# EAGLE design sequencer (EAGLE 5.11)

## Sheet 1 of 3
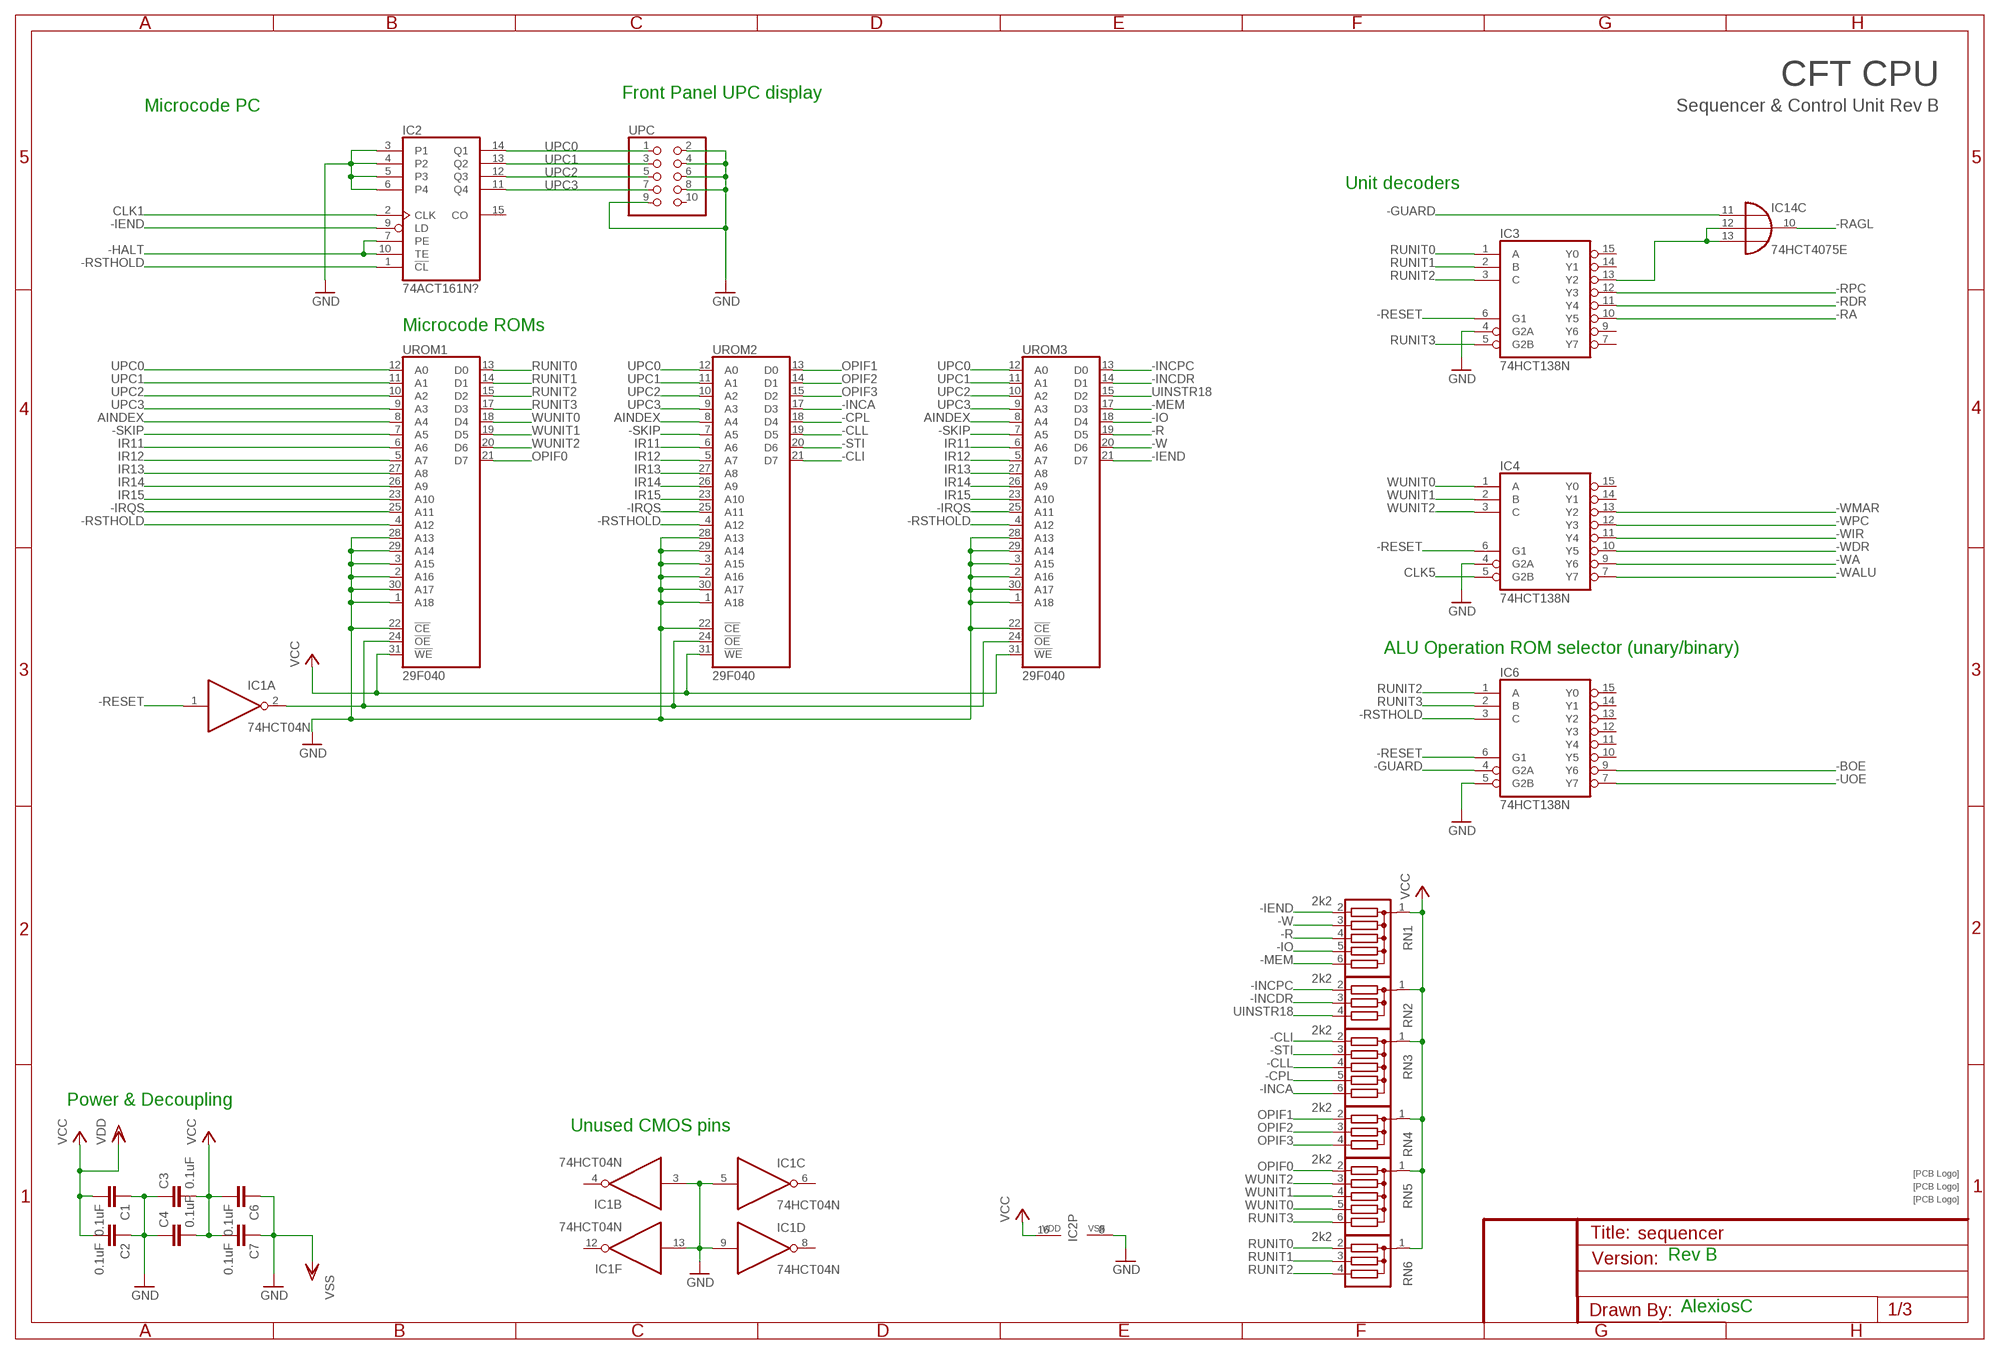
[diagram p0: schematic, sheet 1]

### Parts
C1  0.1uF  C-EU025-025X050  [C025-025X050]
C2  0.1uF  C-EU025-025X050  [C025-025X050]
C3  0.1uF  C-EU025-025X050  [C025-025X050]
C4  0.1uF  C-EU025-025X050  [C025-025X050]
C6  0.1uF  C-EU025-025X050  [C025-025X050]
C7  0.1uF  C-EU025-025X050  [C025-025X050]
IC1  74HCT04N  [DIL14]
IC2  74ACT161N?  4161P  [DIL16]
IC3  74HCT138N  [DIL16]
IC4  74HCT138N  [DIL16]
IC6  74HCT138N  [DIL16]
IC14  74HCT4075E  4075N  [DIL14]
RN1  2k2  G05R  [SIL6]
RN2  2k2  G03R  [SIL4]
RN3  2k2  G05R  [SIL6]
RN4  2k2  G03R  [SIL4]
RN5  2k2  G05R  [SIL6]
RN6  2k2  G03R  [SIL4]
U$1  SIGNATUREPLANE  [SIGNATURE_PLANE]
U$2  SIGNATUREPLANE  [SIGNATURE_PLANE]
U$3  SIGNATURESILK  [SIGNATURE]
UPC  PINHD-2X5/90  [2X05/90]
UROM1  29F040  29F040DIP32  [DIL32]
UROM2  29F040  29F040DIP32  [DIL32]
UROM3  29F040  29F040DIP32  [DIL32]

### Nets
-BOE: IC6.9(Y6) ; also sheet 3
-CLI: RN3.2 UROM2.21(D7) ; also sheet 3
-CLL: RN3.4 UROM2.19(D5) ; also sheet 3
-CPL: RN3.5 UROM2.18(D4) ; also sheet 3
-GUARD: IC6.4(G2A) IC14.11(C:I0) ; also sheet 3
-HALT: IC2.7(PE) IC2.10(TE) ; also sheet 3
-IEND: IC2.9(LD) RN1.2 UROM3.21(D7) ; also sheet 3
-INCA: RN3.6 UROM2.17(D3) ; also sheet 3
-INCDR: RN2.3 UROM3.14(D1) ; also sheet 3
-INCPC: RN2.2 UROM3.13(D0) ; also sheet 3
-IO: RN1.5 UROM3.18(D4) ; also sheet 3
-IRQS: UROM1.25(A11) UROM2.25(A11) UROM3.25(A11) ; also sheet 3
-MEM: RN1.6 UROM3.17(D3) ; also sheet 3
-R: RN1.4 UROM3.19(D5) ; also sheet 3
-RA: IC3.10(Y5) ; also sheet 3
-RAGL: IC14.10(C:O) ; also sheet 2,3
-RDR: IC3.11(Y4) ; also sheet 3
-RESET: IC1.1(A:I) IC3.6(G1) IC4.6(G1) IC6.6(G1) ; also sheet 2,3
-RPC: IC3.12(Y3) ; also sheet 3
-RSTHOLD: IC2.1(!CL) IC6.3(C) UROM1.4(A12) UROM2.4(A12) UROM3.4(A12) ; also sheet 2,3
-SKIP: UROM1.7(A5) UROM2.7(A5) UROM3.7(A5) ; also sheet 2,3
-STI: RN3.3 UROM2.20(D6) ; also sheet 3
-UOE: IC6.7(Y7) ; also sheet 3
-W: RN1.3 UROM3.20(D6) ; also sheet 3
-WA: IC4.9(Y6) ; also sheet 3
-WALU: IC4.7(Y7) ; also sheet 3
-WDR: IC4.10(Y5) ; also sheet 3
-WIR: IC4.11(Y4) ; also sheet 2,3
-WMAR: IC4.13(Y2) ; also sheet 3
-WPC: IC4.12(Y3) ; also sheet 3
AINDEX: UROM1.8(A4) UROM2.8(A4) UROM3.8(A4) ; also sheet 3
CLK1: IC2.2(CLK) ; also sheet 2,3
CLK5: IC4.5(G2B) ; also sheet 3
GND [Power]: C1.1 C2.1 C3.1 C4.1 C6.1 C7.1 IC1.3(B:I) IC1.5(C:I) IC1.9(D:I) IC1.13(F:I) IC2.3(P1) IC2.4(P2) IC2.5(P3) IC2.6(P4) IC2.8(VSS) IC3.4(G2A) IC4.4(G2A) IC6.5(G2B) UPC.2 UPC.4 UPC.6 UPC.8 UPC.9 UROM1.1(A18) UROM1.2(A16) UROM1.3(A15) UROM1.22(!CE) UROM1.28(A13) UROM1.29(A14) UROM1.30(A17) UROM2.1(A18) UROM2.2(A16) UROM2.3(A15) UROM2.22(!CE) UROM2.28(A13) UROM2.29(A14) UROM2.30(A17) UROM3.1(A18) UROM3.2(A16) UROM3.3(A15) UROM3.22(!CE) UROM3.28(A13) UROM3.29(A14) UROM3.30(A17) ; supply symbol labelled VSS ; also sheet 2,3
IR11: UROM1.6(A6) UROM2.6(A6) UROM3.6(A6) ; also sheet 2
IR12: UROM1.5(A7) UROM2.5(A7) UROM3.5(A7) ; also sheet 2
IR13: UROM1.27(A8) UROM2.27(A8) UROM3.27(A8) ; also sheet 2
IR14: UROM1.26(A9) UROM2.26(A9) UROM3.26(A9) ; also sheet 2
IR15: UROM1.23(A10) UROM2.23(A10) UROM3.23(A10) ; also sheet 2
N$1: IC1.2(A:O) UROM1.24(!OE) UROM2.24(!OE) UROM3.24(!OE)
N$3: IC3.13(Y2) IC14.12(C:I1) IC14.13(C:I2)
OPIF0: RN5.2 UROM1.21(D7) ; also sheet 2,3
OPIF1: RN4.2 UROM2.13(D0) ; also sheet 2,3
OPIF2: RN4.3 UROM2.14(D1) ; also sheet 2,3
OPIF3: RN4.4 UROM2.15(D2) ; also sheet 2,3
RUNIT0: IC3.1(A) RN6.2 UROM1.13(D0) ; also sheet 3
RUNIT1: IC3.2(B) RN6.3 UROM1.14(D1) ; also sheet 3
RUNIT2: IC3.3(C) IC6.1(A) RN6.4 UROM1.15(D2) ; also sheet 3
RUNIT3: IC3.5(G2B) IC6.2(B) RN5.6 UROM1.17(D3) ; also sheet 3
UINSTR18: RN2.4 UROM3.15(D2) ; also sheet 3
UPC0: IC2.14(Q1) UPC.1 UROM1.12(A0) UROM2.12(A0) UROM3.12(A0)
UPC1: IC2.13(Q2) UPC.3 UROM1.11(A1) UROM2.11(A1) UROM3.11(A1)
UPC2: IC2.12(Q3) UPC.5 UROM1.10(A2) UROM2.10(A2) UROM3.10(A2)
UPC3: IC2.11(Q4) UPC.7 UROM1.9(A3) UROM2.9(A3) UROM3.9(A3)
VCC [Power]: C1.2 C2.2 C3.2 C4.2 C6.2 C7.2 IC2.16(VDD) RN1.1 RN2.1 RN3.1 RN4.1 RN5.1 RN6.1 UROM1.31(!WE) UROM2.31(!WE) UROM3.31(!WE) ; supply symbol labelled VDD ; also sheet 2,3
WUNIT0: IC4.1(A) RN5.5 UROM1.18(D4)
WUNIT1: IC4.2(B) RN5.4 UROM1.19(D5)
WUNIT2: IC4.3(C) RN5.3 UROM1.20(D6)
Unconnected: IC1.4(B:O) IC1.6(C:O) IC1.8(D:O) IC1.12(F:O) IC2.15(CO) IC3.7(Y7) IC3.9(Y6) IC3.14(Y1) IC3.15(Y0) IC4.14(Y1) IC4.15(Y0) IC6.10(Y5) IC6.11(Y4) IC6.12(Y3) IC6.13(Y2) IC6.14(Y1) IC6.15(Y0) UPC.10

### Notes on the sheet
- CFT CPU
- Front Panel UPC display
- Microcode PC | Sequencer & Control Unit Rev B
- Unit decoders
- Microcode ROMs
- ALU Operation ROM selector (unary/binary)
- Power & Decoupling
- Unused CMOS pins
- Rev B
- AlexiosC

## Sheet 2 of 3
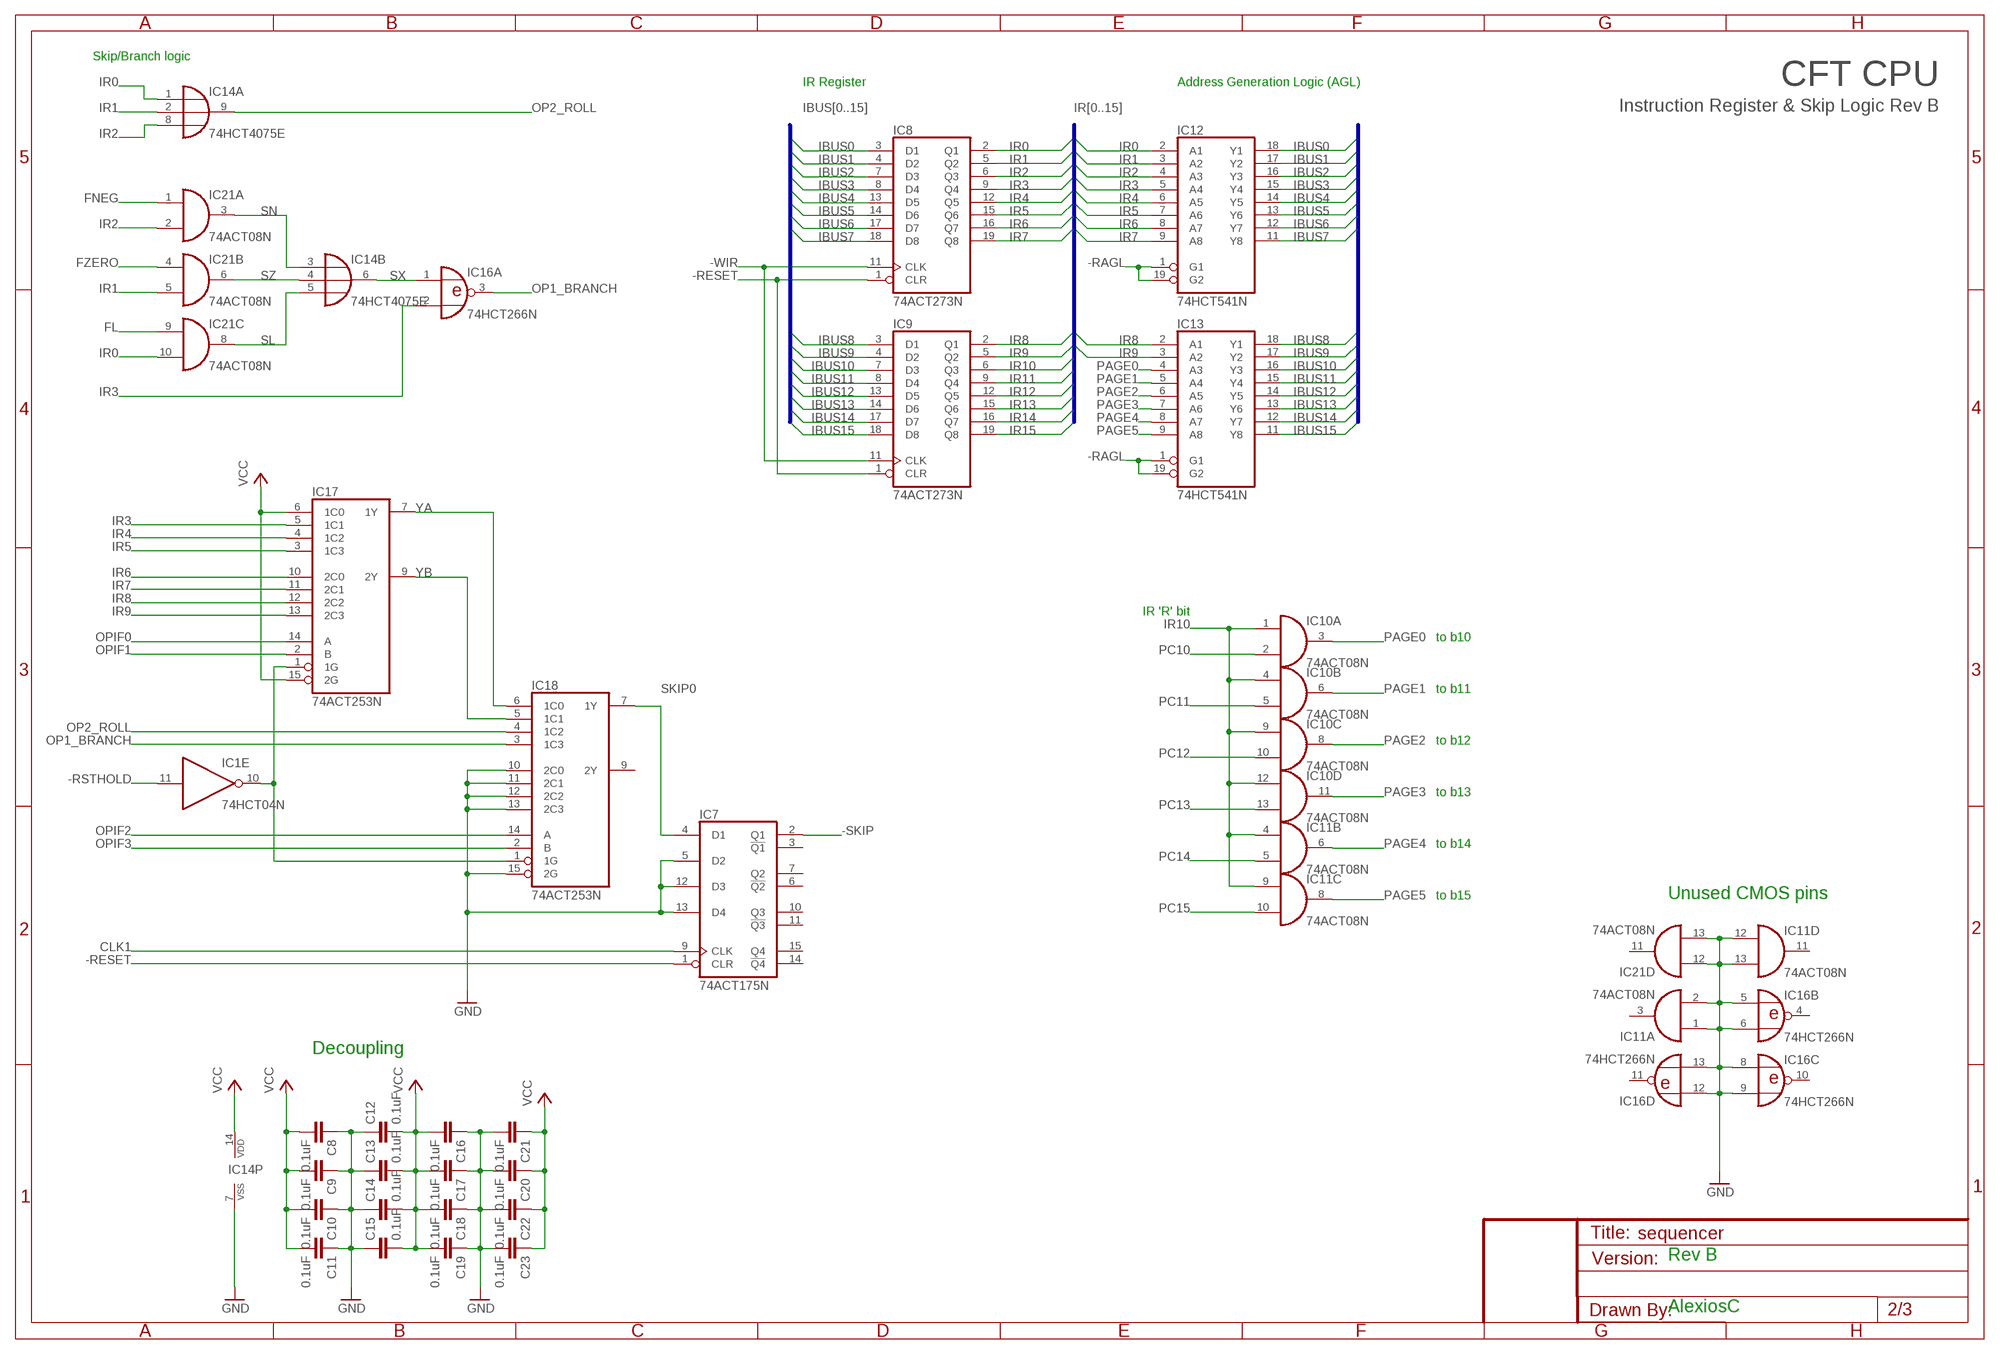
[diagram p1: schematic, sheet 2]

### Parts
C8  0.1uF  C-EU025-025X050  [C025-025X050]
C9  0.1uF  C-EU025-025X050  [C025-025X050]
C10  0.1uF  C-EU025-025X050  [C025-025X050]
C11  0.1uF  C-EU025-025X050  [C025-025X050]
C12  0.1uF  C-EU025-025X050  [C025-025X050]
C13  0.1uF  C-EU025-025X050  [C025-025X050]
C14  0.1uF  C-EU025-025X050  [C025-025X050]
C15  0.1uF  C-EU025-025X050  [C025-025X050]
C16  0.1uF  C-EU025-025X050  [C025-025X050]
C17  0.1uF  C-EU025-025X050  [C025-025X050]
C18  0.1uF  C-EU025-025X050  [C025-025X050]
C19  0.1uF  C-EU025-025X050  [C025-025X050]
C20  0.1uF  C-EU025-025X050  [C025-025X050]
C21  0.1uF  C-EU025-025X050  [C025-025X050]
C22  0.1uF  C-EU025-025X050  [C025-025X050]
C23  0.1uF  C-EU025-025X050  [C025-025X050]
IC7  74ACT175N  [DIL16]
IC8  74ACT273N  [DIL20]
IC9  74ACT273N  [DIL20]
IC10  74ACT08N  [DIL14]
IC11  74ACT08N  [DIL14]
IC12  74HCT541N  [DIL20]
IC13  74HCT541N  [DIL20]
IC16  74HCT266N  74HC266N  [DIL14]
IC17  74ACT253N  [DIL16]
IC18  74ACT253N  [DIL16]
IC21  74ACT08N  [DIL14]

### Nets
-RAGL: IC12.1(G1) IC12.19(G2) IC13.1(G1) IC13.19(G2) ; also sheet 1,3
-RESET: IC7.1(CLR) IC8.1(CLR) IC9.1(CLR) ; also sheet 1,3
-RSTHOLD: IC1.11(E:I) ; also sheet 1,3
-SKIP: IC7.2(Q1) ; also sheet 1,3
-WIR: IC8.11(CLK) IC9.11(CLK) ; also sheet 1,3
CLK1: IC7.9(CLK) ; also sheet 1,3
FL: IC21.9(C:I0) ; also sheet 3
FNEG: IC21.1(A:I0) ; also sheet 3
FZERO: IC21.4(B:I0) ; also sheet 3
GND [Power]: C8.1 C9.1 C10.1 C11.1 C12.1 C13.1 C14.1 C15.1 C16.1 C17.1 C18.1 C19.1 C20.2 C21.2 C22.2 C23.2 IC7.5(D2) IC7.12(D3) IC7.13(D4) IC11.1(A:I0) IC11.2(A:I1) IC11.12(D:I0) IC11.13(D:I1) IC14.7(P:VSS) IC16.5(B:I0) IC16.6(B:I1) IC16.8(C:I0) IC16.9(C:I1) IC16.12(D:I0) IC16.13(D:I1) IC18.10(2C0) IC18.11(2C1) IC18.12(2C2) IC18.13(2C3) IC18.15(2G) IC21.12(D:I0) IC21.13(D:I1) ; also sheet 1,3
IBUS0: IC8.3(D1) IC12.18(Y1) ; also sheet 3
IBUS1: IC8.4(D2) IC12.17(Y2) ; also sheet 3
IBUS2: IC8.7(D3) IC12.16(Y3) ; also sheet 3
IBUS3: IC8.8(D4) IC12.15(Y4) ; also sheet 3
IBUS4: IC8.13(D5) IC12.14(Y5) ; also sheet 3
IBUS5: IC8.14(D6) IC12.13(Y6) ; also sheet 3
IBUS6: IC8.17(D7) IC12.12(Y7) ; also sheet 3
IBUS7: IC8.18(D8) IC12.11(Y8) ; also sheet 3
IBUS8: IC9.3(D1) IC13.18(Y1) ; also sheet 3
IBUS9: IC9.4(D2) IC13.17(Y2) ; also sheet 3
IBUS10: IC9.7(D3) IC13.16(Y3) ; also sheet 3
IBUS11: IC9.8(D4) IC13.15(Y4) ; also sheet 3
IBUS12: IC9.13(D5) IC13.14(Y5) ; also sheet 3
IBUS13: IC9.14(D6) IC13.13(Y6) ; also sheet 3
IBUS14: IC9.17(D7) IC13.12(Y7) ; also sheet 3
IBUS15: IC9.18(D8) IC13.11(Y8) ; also sheet 3
IR0: IC8.2(Q1) IC12.2(A1) IC14.1(A:I0) IC21.10(C:I1)
IR1: IC8.5(Q2) IC12.3(A2) IC14.2(A:I1) IC21.5(B:I1)
IR2: IC8.6(Q3) IC12.4(A3) IC14.8(A:I2) IC21.2(A:I1)
IR3: IC8.9(Q4) IC12.5(A4) IC16.2(A:I1) IC17.5(1C1)
IR4: IC8.12(Q5) IC12.6(A5) IC17.4(1C2)
IR5: IC8.15(Q6) IC12.7(A6) IC17.3(1C3)
IR6: IC8.16(Q7) IC12.8(A7) IC17.10(2C0)
IR7: IC8.19(Q8) IC12.9(A8) IC17.11(2C1)
IR8: IC9.2(Q1) IC13.2(A1) IC17.12(2C2)
IR9: IC9.5(Q2) IC13.3(A2) IC17.13(2C3)
IR10: IC9.6(Q3) IC10.1(A:I0) IC10.4(B:I0) IC10.9(C:I0) IC10.12(D:I0) IC11.4(B:I0) IC11.9(C:I0)
IR11: IC9.9(Q4) ; also sheet 1
IR12: IC9.12(Q5) ; also sheet 1
IR13: IC9.15(Q6) ; also sheet 1
IR14: IC9.16(Q7) ; also sheet 1
IR15: IC9.19(Q8) ; also sheet 1
OP1_BRANCH: IC16.3(A:O) IC18.3(1C3)
OP2_ROLL: IC14.9(A:O) IC18.4(1C2)
OPIF0: IC17.14(A) ; also sheet 1,3
OPIF1: IC17.2(B) ; also sheet 1,3
OPIF2: IC18.14(A) ; also sheet 1,3
OPIF3: IC18.2(B) ; also sheet 1,3
PAGE0: IC10.3(A:O) IC13.4(A3)
PAGE1: IC10.6(B:O) IC13.5(A4)
PAGE2: IC10.8(C:O) IC13.6(A5)
PAGE3: IC10.11(D:O) IC13.7(A6)
PAGE4: IC11.6(B:O) IC13.8(A7)
PAGE5: IC11.8(C:O) IC13.9(A8)
PC10: IC10.2(A:I1) ; also sheet 3
PC11: IC10.5(B:I1) ; also sheet 3
PC12: IC10.10(C:I1) ; also sheet 3
PC13: IC10.13(D:I1) ; also sheet 3
PC14: IC11.5(B:I1) ; also sheet 3
PC15: IC11.10(C:I1) ; also sheet 3
RSTHOLD: IC1.10(E:O) IC17.1(1G) IC18.1(1G)
SKIP0: IC7.4(D1) IC18.7(1Y)
SL: IC14.5(B:I2) IC21.8(C:O)
SN: IC14.3(B:I0) IC21.3(A:O)
SX: IC14.6(B:O) IC16.1(A:I0)
SZ: IC14.4(B:I1) IC21.6(B:O)
VCC [Power]: C8.2 C9.2 C10.2 C11.2 C12.2 C13.2 C14.2 C15.2 C16.2 C17.2 C18.2 C19.2 C20.1 C21.1 C22.1 C23.1 IC14.14(P:VDD) IC17.6(1C0) IC17.15(2G) ; also sheet 1,3
YA: IC17.7(1Y) IC18.6(1C0)
YB: IC17.9(2Y) IC18.5(1C1)
Unconnected: IC7.3(!Q1) IC7.6(!Q2) IC7.7(Q2) IC7.10(Q3) IC7.11(!Q3) IC7.14(!Q4) IC7.15(Q4) IC11.3(A:O) IC11.11(D:O) IC16.4(B:O) IC16.10(C:O) IC16.11(D:O) IC18.9(2Y) IC21.11(D:O)

### Buses
IBUS[0..15]
IR[0..15]

### Notes on the sheet
- Skip/Branch logic
- IR Register | Address Generation Logic (AGL) | CFT CPU
- Instruction Register & Skip Logic Rev B
- IR 'R' bit
- to b10
- to b11
- to b12
- to b13
- to b14
- to b15 | Unused CMOS pins
- Decoupling
- Rev B
- AlexiosC

## Sheet 3 of 3
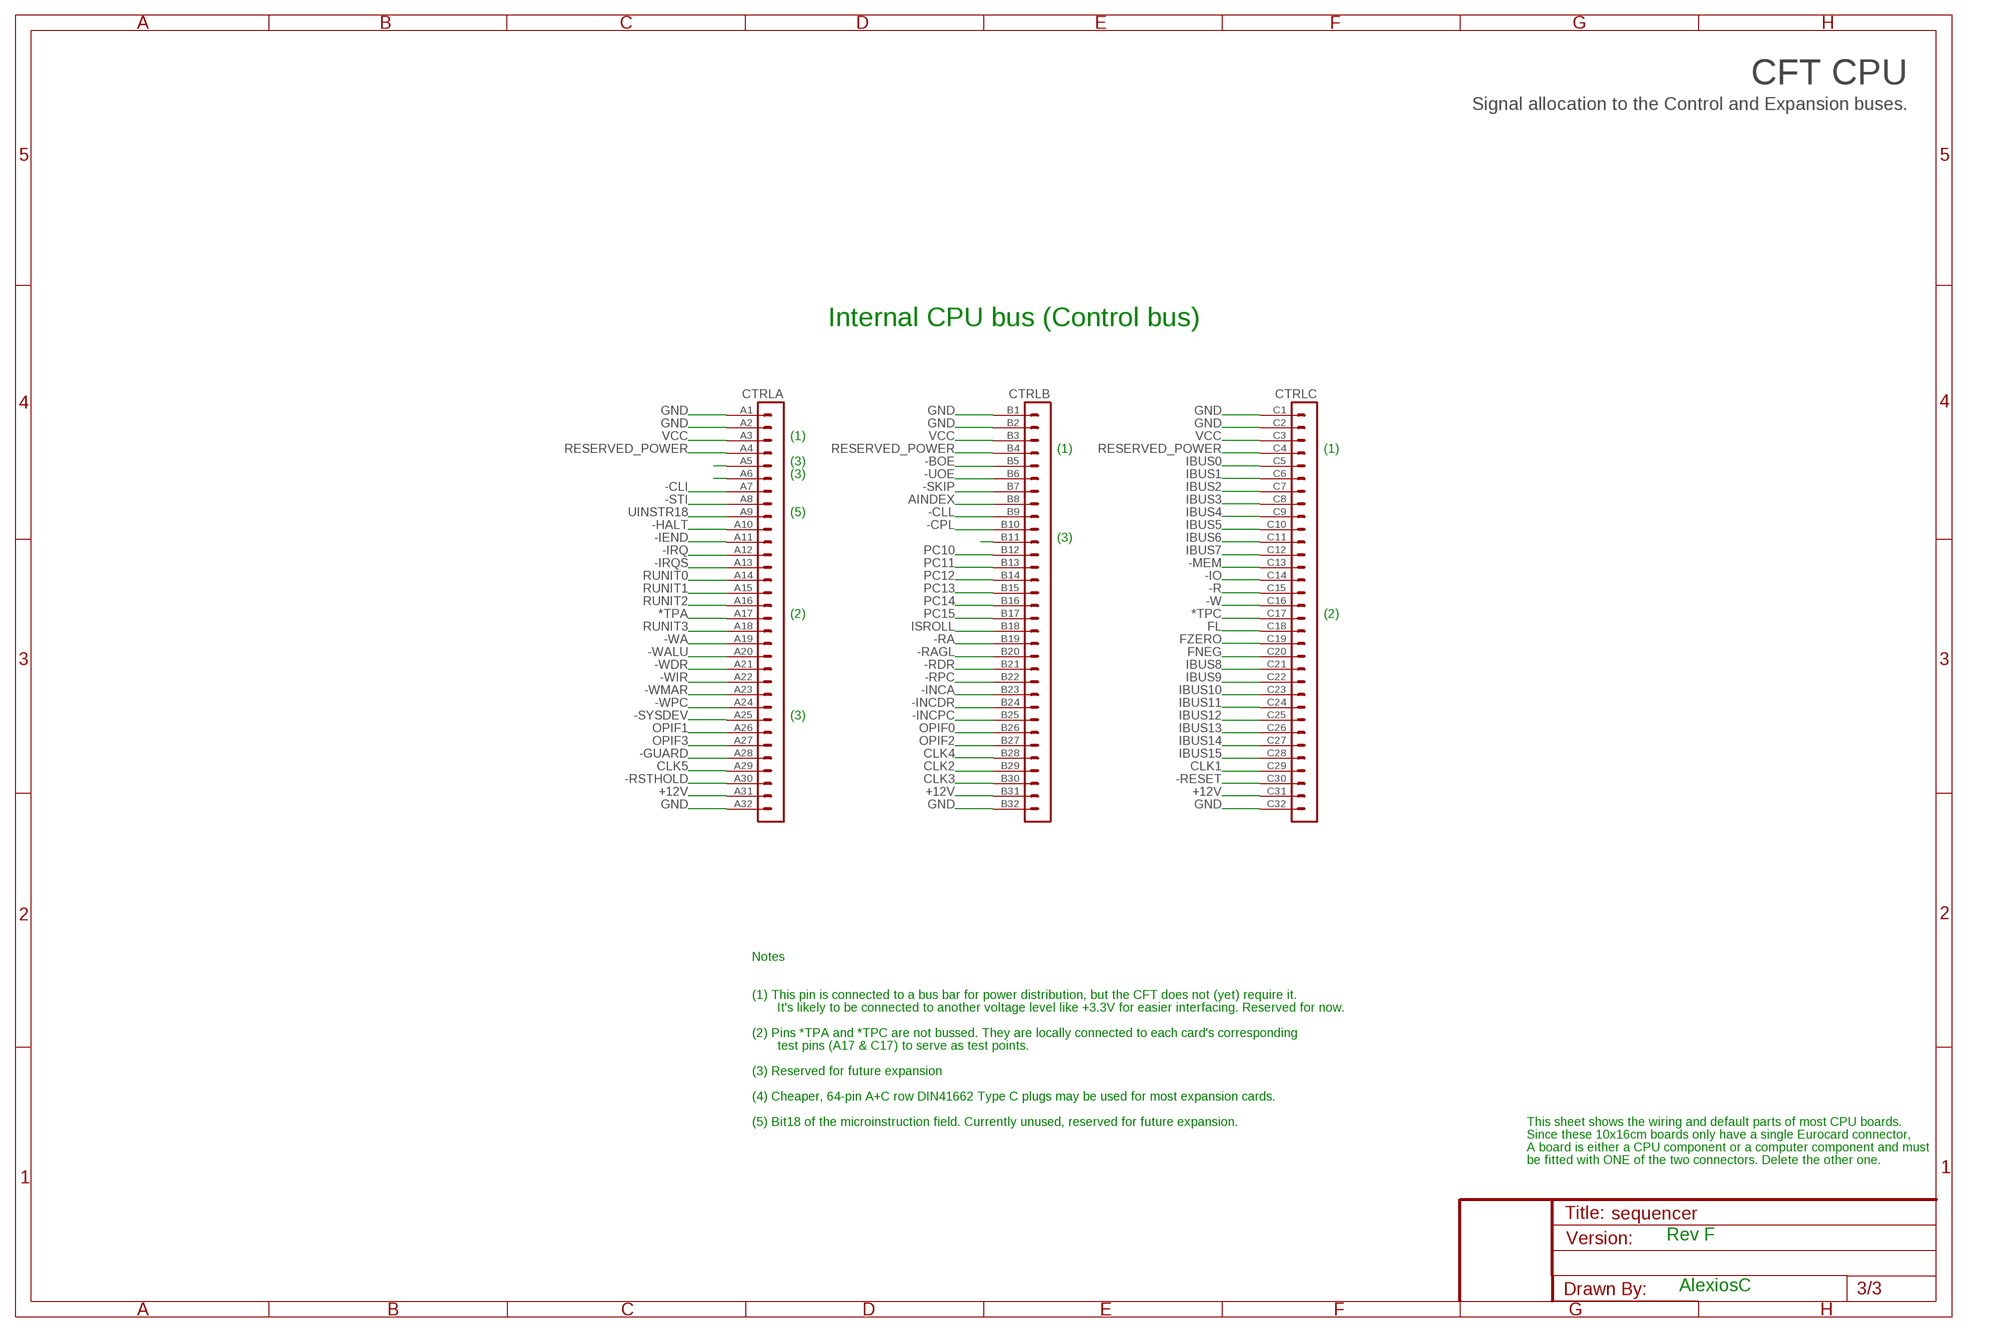
[diagram p2: schematic, sheet 3]

### Parts
CTRL  VG96-3B  [VG96B]

### Nets
*TPA: CTRL.A17
*TPC: CTRL.C17
+12V [12V]: CTRL.A31 CTRL.B31 CTRL.C31
-BOE: CTRL.B5 ; also sheet 1
-CLI: CTRL.A7 ; also sheet 1
-CLL: CTRL.B9 ; also sheet 1
-CPL: CTRL.B10 ; also sheet 1
-GUARD: CTRL.A28 ; also sheet 1
-HALT: CTRL.A10 ; also sheet 1
-IEND: CTRL.A11 ; also sheet 1
-INCA: CTRL.B23 ; also sheet 1
-INCDR: CTRL.B24 ; also sheet 1
-INCPC: CTRL.B25 ; also sheet 1
-IO: CTRL.C14 ; also sheet 1
-IRQ: CTRL.A12
-IRQS: CTRL.A13 ; also sheet 1
-MEM: CTRL.C13 ; also sheet 1
-R: CTRL.C15 ; also sheet 1
-RA: CTRL.B19 ; also sheet 1
-RAGL: CTRL.B20 ; also sheet 1,2
-RDR: CTRL.B21 ; also sheet 1
-RESET: CTRL.C30 ; also sheet 1,2
-RPC: CTRL.B22 ; also sheet 1
-RSTHOLD: CTRL.A30 ; also sheet 1,2
-SKIP: CTRL.B7 ; also sheet 1,2
-STI: CTRL.A8 ; also sheet 1
-SYSDEV: CTRL.A25
-UOE: CTRL.B6 ; also sheet 1
-W: CTRL.C16 ; also sheet 1
-WA: CTRL.A19 ; also sheet 1
-WALU: CTRL.A20 ; also sheet 1
-WDR: CTRL.A21 ; also sheet 1
-WIR: CTRL.A22 ; also sheet 1,2
-WMAR: CTRL.A23 ; also sheet 1
-WPC: CTRL.A24 ; also sheet 1
AINDEX: CTRL.B8 ; also sheet 1
CLK1: CTRL.C29 ; also sheet 1,2
CLK2: CTRL.B29
CLK3: CTRL.B30
CLK4: CTRL.B28
CLK5: CTRL.A29 ; also sheet 1
FL: CTRL.C18 ; also sheet 2
FNEG: CTRL.C20 ; also sheet 2
FZERO: CTRL.C19 ; also sheet 2
GND [Power]: CTRL.A1 CTRL.A2 CTRL.A32 CTRL.B1 CTRL.B2 CTRL.B32 CTRL.C1 CTRL.C2 CTRL.C32 ; also sheet 1,2
IBUS0: CTRL.C5 ; also sheet 2
IBUS1: CTRL.C6 ; also sheet 2
IBUS2: CTRL.C7 ; also sheet 2
IBUS3: CTRL.C8 ; also sheet 2
IBUS4: CTRL.C9 ; also sheet 2
IBUS5: CTRL.C10 ; also sheet 2
IBUS6: CTRL.C11 ; also sheet 2
IBUS7: CTRL.C12 ; also sheet 2
IBUS8: CTRL.C21 ; also sheet 2
IBUS9: CTRL.C22 ; also sheet 2
IBUS10: CTRL.C23 ; also sheet 2
IBUS11: CTRL.C24 ; also sheet 2
IBUS12: CTRL.C25 ; also sheet 2
IBUS13: CTRL.C26 ; also sheet 2
IBUS14: CTRL.C27 ; also sheet 2
IBUS15: CTRL.C28 ; also sheet 2
ISROLL: CTRL.B18
N$13: CTRL.A5
N$47: CTRL.B11
N$51: CTRL.A6
OPIF0: CTRL.B26 ; also sheet 1,2
OPIF1: CTRL.A26 ; also sheet 1,2
OPIF2: CTRL.B27 ; also sheet 1,2
OPIF3: CTRL.A27 ; also sheet 1,2
PC10: CTRL.B12 ; also sheet 2
PC11: CTRL.B13 ; also sheet 2
PC12: CTRL.B14 ; also sheet 2
PC13: CTRL.B15 ; also sheet 2
PC14: CTRL.B16 ; also sheet 2
PC15: CTRL.B17 ; also sheet 2
RESERVED_POWER: CTRL.A4 CTRL.B4 CTRL.C4
RUNIT0: CTRL.A14 ; also sheet 1
RUNIT1: CTRL.A15 ; also sheet 1
RUNIT2: CTRL.A16 ; also sheet 1
RUNIT3: CTRL.A18 ; also sheet 1
UINSTR18: CTRL.A9 ; also sheet 1
VCC [Power]: CTRL.A3 CTRL.B3 CTRL.C3 ; also sheet 1,2

### Notes on the sheet
- CFT CPU
- Signal allocation to the Control and Expansion buses.
- Internal CPU bus (Control bus)
- (1)
- (1) | (1)
- (3)
- (3)
- (5)
- (3)
- (2) | (2)
- (3)
- Notes
- (1) This pin is connected to a bus bar for power distribution, but the CFT does not (yet) require it.
- It's likely to be connected to another voltage level like +3.3V for easier interfacing. Reserved for now.
- (2) Pins *TPA and *TPC are not bussed. They are locally connected to each card's corresponding
- test pins (A17 & C17) to serve as test points.
- (3) Reserved for future expansion
- (4) Cheaper, 64-pin A+C row DIN41662 Type C plugs may be used for most expansion cards.
- (5) Bit18 of the microinstruction field. Currently unused, reserved for future expansion. | This sheet shows the wiring and default parts of most CPU boards.
- Since these 10x16cm boards only have a single Eurocard connector,
- A board is either a CPU component or a computer component and must
- be fitted with ONE of the two connectors. Delete the other one.
- Rev F
- AlexiosC

## Power pins joined to a net without a drawn wire
GND: IC1.7(P:GND) IC3.8(GND) IC4.8(GND) IC6.8(GND) IC7.8(GND) IC8.10(GND) IC9.10(GND) IC10.7(P:GND) IC11.7(P:GND) IC12.10(GND) IC13.10(GND) IC16.7(P:GND) IC17.8(GND) IC18.8(GND) IC21.7(P:GND) UROM1.16(GND) UROM2.16(GND) UROM3.16(GND)
VCC: IC1.14(P:VCC) IC3.16(VCC) IC4.16(VCC) IC6.16(VCC) IC7.16(VCC) IC8.20(VCC) IC9.20(VCC) IC10.14(P:VCC) IC11.14(P:VCC) IC12.20(VCC) IC13.20(VCC) IC16.14(P:VCC) IC17.16(VCC) IC18.16(VCC) IC21.14(P:VCC) UROM1.32(VCC) UROM2.32(VCC) UROM3.32(VCC)

## Library data of the parts
C1-C4 C6-C23 = rcl:C-EU: CAPACITOR, European symbol
CTRL = 19inch:VG96-3: PCB EUROCARD, 96-pin type C/ABC, 2.54 mm
IC1 = 74xx-eu:74*04: Hex INVERTER
IC2 = 41xx:4161: 41xx DEVICE
IC3 IC4 IC6 = 74xx-eu:74*138: 3-line to 8-line DECODER/DEMULTIPLEXER
IC7 = 74xx-eu:74*175: Qadruple D type FLIP FLOP, clear
IC8 IC9 = 74xx-eu:74*273: Octal D type FLIP FLOP, clear
IC10 IC11 IC21 = 74xx-eu:74*08: Quad 2-input AND gate
IC12 IC13 = 74xx-eu:74*541: Octal BUFFER and LINE DRIVER, 3-state
IC14 = 40xx:4075: Triple 3-input OR
IC16 = 74xx-eu:74*266: Quadruple EXCLUSIVE-NOR (XNOR), open-collector
IC17 IC18 = 74xx-eu:74*253: Dual 4-to 1 line data SELECTOR/MULTIPLEXER, 3-state
RN1 RN3 RN5 = resistor-sil:G05R: SIL RESISTOR; OC_FARNELL: unknown; OC_NEWARK: unknown
RN2 RN4 RN6 = resistor-sil:G03R: SIL RESISTOR; OC_FARNELL: unknown; OC_NEWARK: unknown
U$1-U$3 = alexios:SIGNATURE: Soup signature
UPC = pinhead:PINHD-2X5: PIN HEADER
UROM1-UROM3 = alexios:29F040: 4-mbit (512x8) Flash memory in a PLCC32 package (with socket). AM29F040 is an example of this.

## Net classes
0 default: width 0.305 mm, clearance 0.254 mm
1 Power: width 0.914 mm, clearance 0.254 mm
2 12V: width 1.27 mm, clearance 0.508 mm

## Board
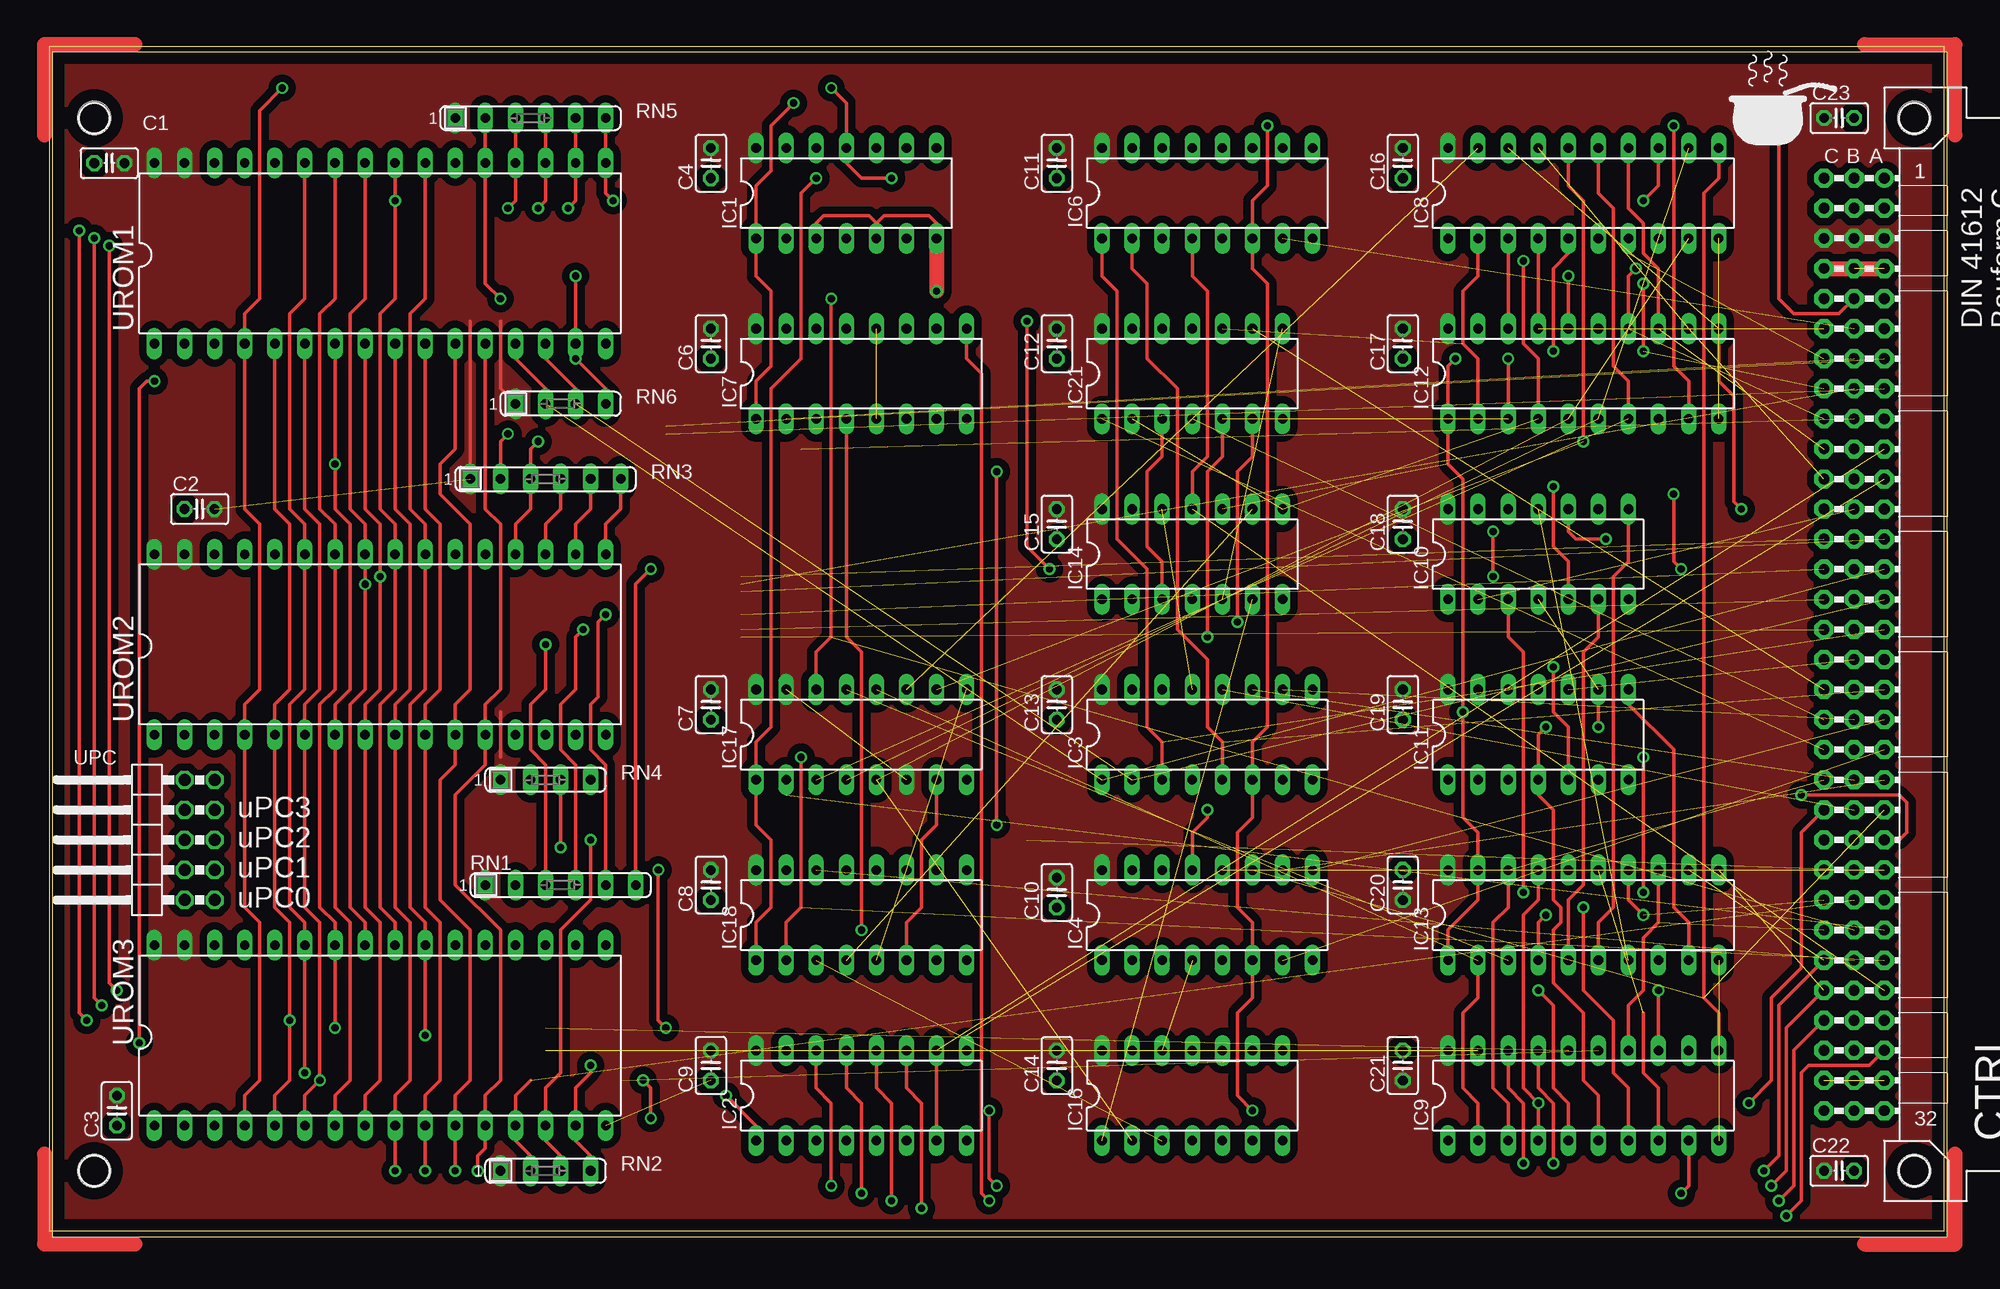
[diagram p3: board, top side]
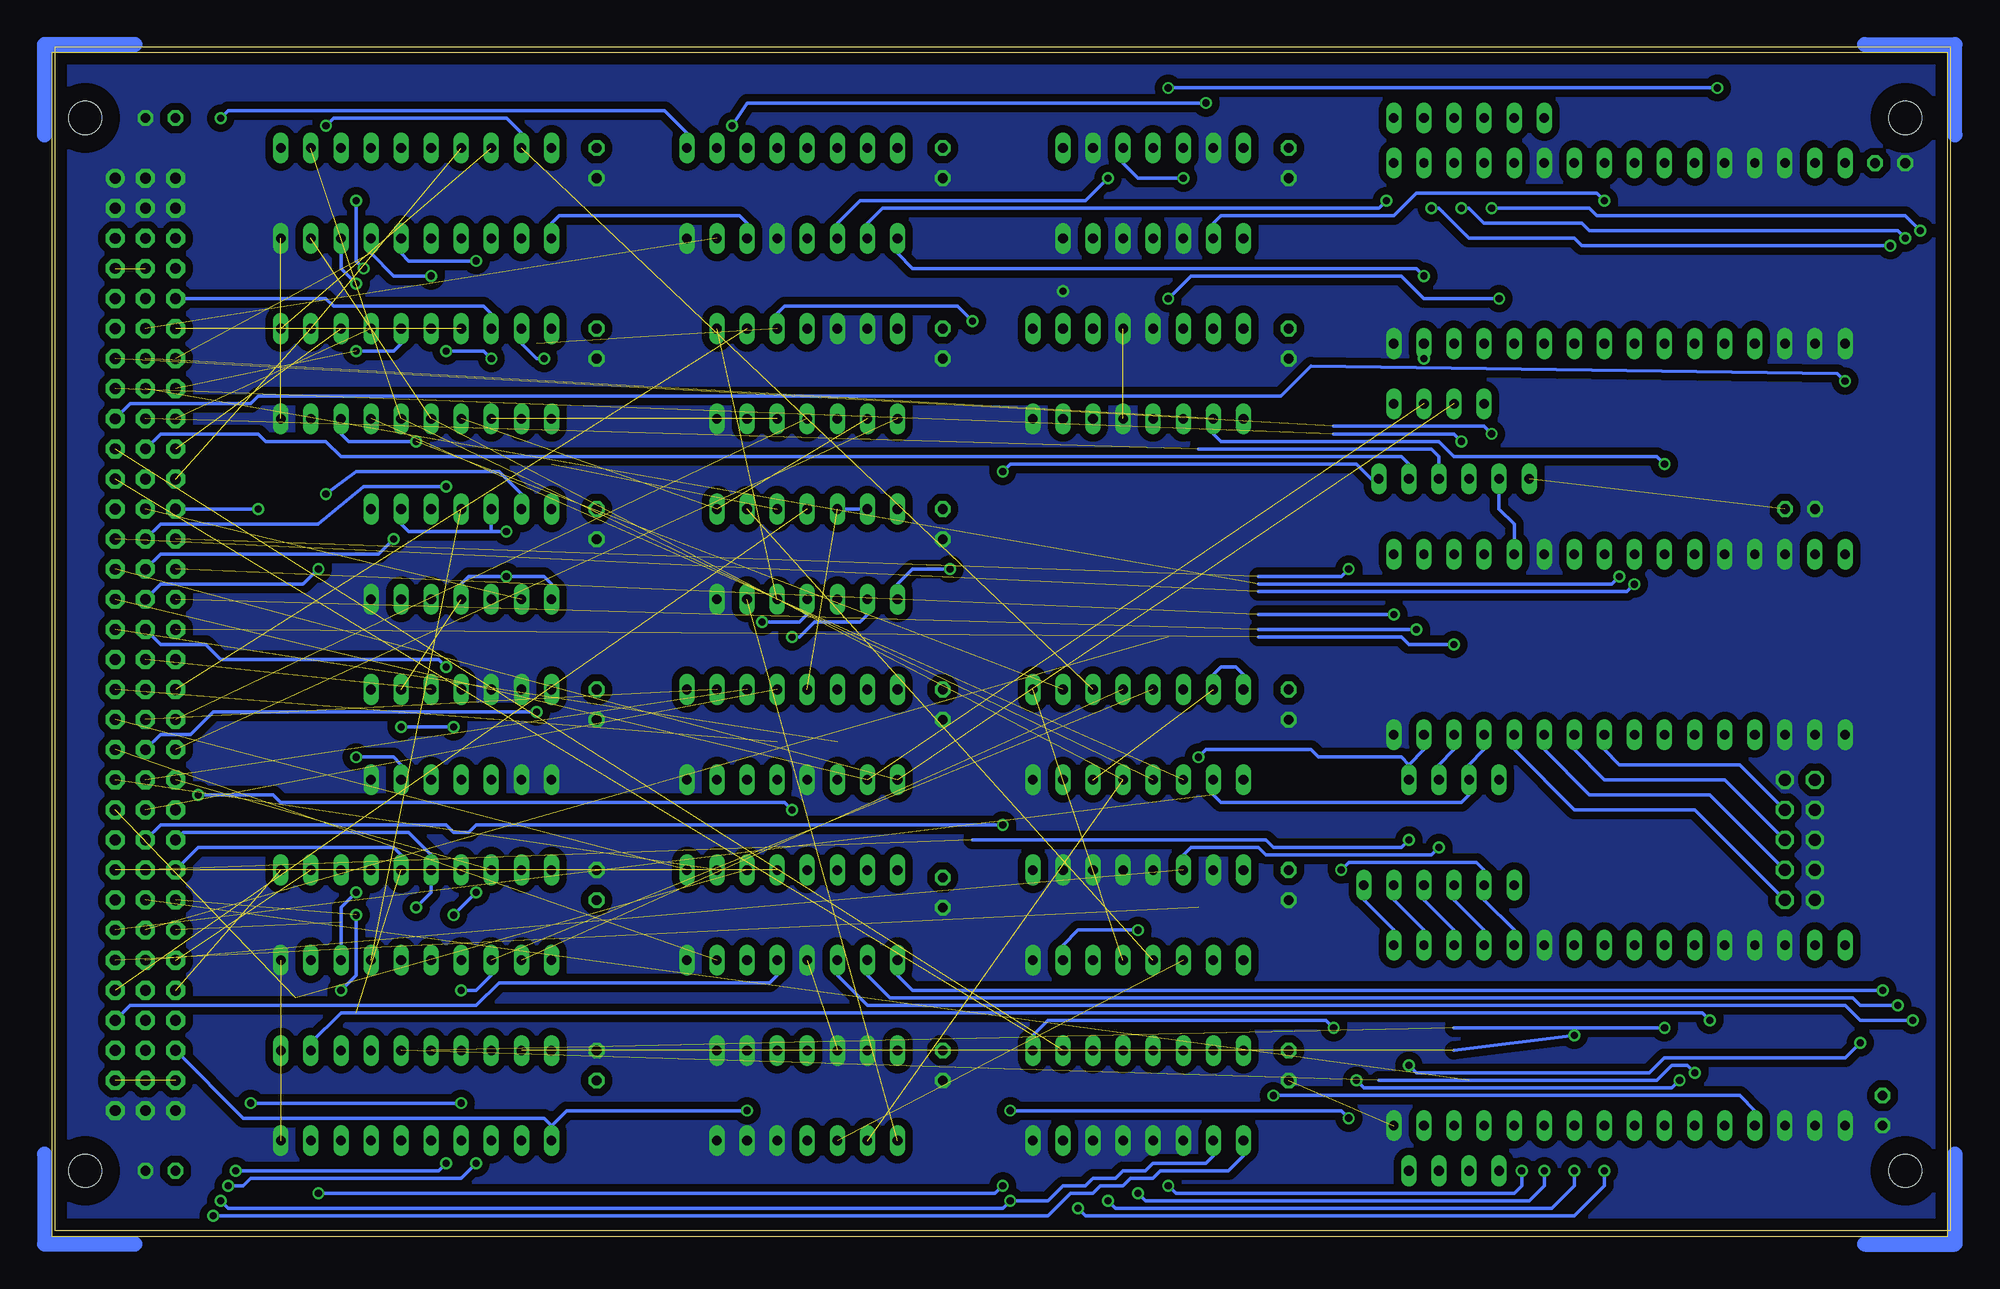
[diagram p4: board, bottom side, seen from below]

Size 160 x 100 mm. Coordinates in mm from the lower left corner, seen from the top.
Outline: 0,0 160,0 160,100 0,100 0,0
Copper layers (1*16): Top 0.035mm / dielectric 1.5mm / Bottom 0.035mm
Design rules "olimex-10mil": minimum track width 10mil, minimum drill 24mil, track to track 10mil, track to pad 10mil, pad to pad 10mil, via to via 10mil, smd to smd 10mil, copper to edge 40mil, drill to drill 10mil, minimum pad ring 10mil, minimum via ring 8mil, stop-mask expansion 0mil, vias tented up to drill 0mil, thermal gap 10mil

### Footprints (pad centres in the part's own frame; a part is rotated, then mirrored left to right if it is on the bottom)
C025-025X050 = drill 0.813 octagon: 1 -1.27,0; 2 1.27,0
VG96B = drill 0.914 pad 1.6 round: A1 154.94,39.37 | drill 0.914 pad 1.6 octagon: A2 154.94,36.83; A3 154.94,34.29; A4 154.94,31.75; A5 154.94,29.21; A6 154.94,26.67; A7 154.94,24.13; A8 154.94,21.59; A9 154.94,19.05; A10 154.94,16.51; A11 154.94,13.97; A12 154.94,11.43; A13 154.94,8.89; A14 154.94,6.35; A15 154.94,3.81; A16 154.94,1.27; A17 154.94,-1.27; A18 154.94,-3.81; A19 154.94,-6.35; A20 154.94,-8.89; A21 154.94,-11.43; A22 154.94,-13.97; A23 154.94,-16.51; A24 154.94,-19.05; A25 154.94,-21.59; A26 154.94,-24.13; A27 154.94,-26.67; A28 154.94,-29.21; A29 154.94,-31.75; A30 154.94,-34.29; A31 154.94,-36.83; A32 154.94,-39.37; B1 152.4,39.37; B2 152.4,36.83; B3 152.4,34.29; B4 152.4,31.75; B5 152.4,29.21; B6 152.4,26.67; B7 152.4,24.13; B8 152.4,21.59; B9 152.4,19.05; B10 152.4,16.51; B11 152.4,13.97; B12 152.4,11.43; B13 152.4,8.89; B14 152.4,6.35; B15 152.4,3.81; B16 152.4,1.27; B17 152.4,-1.27; B18 152.4,-3.81; B19 152.4,-6.35; B20 152.4,-8.89; B21 152.4,-11.43; B22 152.4,-13.97; B23 152.4,-16.51; B24 152.4,-19.05; B25 152.4,-21.59; B26 152.4,-24.13; B27 152.4,-26.67; B28 152.4,-29.21; B29 152.4,-31.75; B30 152.4,-34.29; B31 152.4,-36.83; B32 152.4,-39.37; C1 149.86,39.37; C2 149.86,36.83; C3 149.86,34.29; C4 149.86,31.75; C5 149.86,29.21; C6 149.86,26.67; C7 149.86,24.13; C8 149.86,21.59; C9 149.86,19.05; C10 149.86,16.51; C11 149.86,13.97; C12 149.86,11.43; C13 149.86,8.89; C14 149.86,6.35; C15 149.86,3.81; C16 149.86,1.27; C17 149.86,-1.27; C18 149.86,-3.81; C19 149.86,-6.35; C20 149.86,-8.89; C21 149.86,-11.43; C22 149.86,-13.97; C23 149.86,-16.51; C24 149.86,-19.05; C25 149.86,-21.59; C26 149.86,-24.13; C27 149.86,-26.67; C28 149.86,-29.21; C29 149.86,-31.75; C30 149.86,-34.29; C31 149.86,-36.83; C32 149.86,-39.37 | hole 2.794: 157.48,44.45; 157.48,-44.45; 3.81,44.45; 3.81,-44.45
DIL14 = drill 0.813 long: 1 -7.62,-3.81; 2 -5.08,-3.81; 3 -2.54,-3.81; 4 0,-3.81; 5 2.54,-3.81; 6 5.08,-3.81; 7 7.62,-3.81; 8 7.62,3.81; 9 5.08,3.81; 10 2.54,3.81; 11 0,3.81; 12 -2.54,3.81; 13 -5.08,3.81; 14 -7.62,3.81
DIL16 = drill 0.813 long: 1 -8.89,-3.81; 2 -6.35,-3.81; 3 -3.81,-3.81; 4 -1.27,-3.81; 5 1.27,-3.81; 6 3.81,-3.81; 7 6.35,-3.81; 8 8.89,-3.81; 9 8.89,3.81; 10 6.35,3.81; 11 3.81,3.81; 12 1.27,3.81; 13 -1.27,3.81; 14 -3.81,3.81; 15 -6.35,3.81; 16 -8.89,3.81
DIL20 = drill 0.813 long: 1 -11.43,-3.81; 2 -8.89,-3.81; 3 -6.35,-3.81; 4 -3.81,-3.81; 5 -1.27,-3.81; 6 1.27,-3.81; 7 3.81,-3.81; 8 6.35,-3.81; 9 8.89,-3.81; 10 11.43,-3.81; 11 11.43,3.81; 12 8.89,3.81; 13 6.35,3.81; 14 3.81,3.81; 15 1.27,3.81; 16 -1.27,3.81; 17 -3.81,3.81; 18 -6.35,3.81; 19 -8.89,3.81; 20 -11.43,3.81
SIL6 = drill 0.813 long: 1 -6.35,0; 2 -3.81,0; 3 -1.27,0; 4 1.27,0; 5 3.81,0; 6 6.35,0
SIL4 = drill 0.813 long: 1 -3.81,0; 2 -1.27,0; 3 1.27,0; 4 3.81,0
2X05/90 = drill 1.016 octagon: 1 -5.08,-6.35; 2 -5.08,-3.81; 3 -2.54,-6.35; 4 -2.54,-3.81; 5 0,-6.35; 6 0,-3.81; 7 2.54,-6.35; 8 2.54,-3.81; 9 5.08,-6.35; 10 5.08,-3.81
DIL32 = drill 0.813 long: 1 -19.05,-7.62; 2 -16.51,-7.62; 3 -13.97,-7.62; 4 -11.43,-7.62; 5 -8.89,-7.62; 6 -6.35,-7.62; 7 -3.81,-7.62; 8 -1.27,-7.62; 9 1.27,-7.62; 10 3.81,-7.62; 11 6.35,-7.62; 12 8.89,-7.62; 13 11.43,-7.62; 14 13.97,-7.62; 15 16.51,-7.62; 16 19.05,-7.62 | drill 0.8 long: 17 19.05,7.62; 18 16.51,7.62; 19 13.97,7.62; 20 11.43,7.62; 21 8.89,7.62; 22 6.35,7.62; 23 3.81,7.62; 24 1.27,7.62; 25 -1.27,7.62; 26 -3.81,7.62; 27 -6.35,7.62; 28 -8.89,7.62; 29 -11.43,7.62; 30 -13.97,7.62; 31 -16.51,7.62; 32 -19.05,7.62

### Placement (x,y rotation side)
C1  5.08,90.17 0 top
C2  12.7,60.96 0 top
C3  5.71,10.16 90 top
C4  55.88,90.17 90 top
C6  55.88,74.93 90 top
C7  55.88,44.45 90 top
C8  55.88,29.21 90 top
C9  55.88,13.97 90 top
C10  85.09,28.57 90 top
C11  85.09,90.17 90 top
C12  85.09,74.93 90 top
C13  85.09,44.45 90 top
C14  85.09,13.97 90 top
C15  85.09,59.69 90 top
C16  114.3,90.17 90 top
C17  114.3,74.93 90 top
C18  114.3,59.69 90 top
C19  114.3,44.45 90 top
C20  114.3,29.21 90 top
C21  114.3,13.97 90 top
C22  151.13,5.08 0 top
C23  151.13,93.98 0 top
CTRL  0,49.53 0 top
IC1  67.31,87.63 0 top
IC2  68.58,11.43 0 top
IC3  97.79,41.91 0 top
IC4  97.79,26.67 0 top
IC6  97.79,87.63 0 top
IC7  68.58,72.39 0 top
IC8  129.54,87.63 0 top
IC9  129.54,11.43 0 top
IC10  125.73,57.15 0 top
IC11  125.73,41.91 0 top
IC12  129.54,72.39 0 top
IC13  129.54,26.67 0 top
IC14  96.52,57.15 0 top
IC16  96.52,11.43 0 top
IC17  68.58,41.91 0 top
IC18  68.58,26.67 0 top
IC21  96.52,72.39 0 top
RN1  43.18,29.21 0 top
RN2  41.91,5.08 0 top
RN3  41.91,63.5 0 top
RN4  41.91,38.1 0 top
RN5  40.64,93.98 0 top
RN6  43.18,69.85 0 top
U$1  36.2,106.68 0 bottom  (outside the outline)
U$2  18.41,106.68 0 top  (outside the outline)
U$3  142.24,91.44 0 top
UPC  7.62,33.02 90 top
UROM1  27.94,82.55 0 top
UROM2  27.94,49.53 0 top
UROM3  27.94,16.51 0 top

### Tracks (layer width: path | path; a pad name or v marks a point on that pad's centre or on a via)
+12V  (2 unrouted)
-BOE  (via drill 0.6)
  Top 0.305: v146.05,93.98 146.05,78.74 147.32,77.47 151.13,77.47 CTRL.B5
  Bottom 0.305: IC6.9 106.68,92.71 108.58,94.61 145.41,94.61 v146.05,93.98
-CLI  (via drill 0.6)  (1 unrouted)
  Top 0.305: RN3.2 38.1,66.67 v38.73,67.31
  Bottom 0.305: UROM2.21 36.83,59.69 38.1,60.96 RN3.2 | v38.73,67.31 39.37,67.94 52.07,67.94
-CLL  (1 unrouted)
  Top 0.305: UROM2.19 41.91,59.69 43.18,60.96 RN3.4
  Bottom 0.305: RN3.4 43.18,65.41 43.81,66.04 63.5,66.04
-CPL
  Top 0.305: UROM2.18 44.45,59.69 45.72,60.96 RN3.5
  Bottom 0.305: RN3.5 45.72,64.77 46.35,65.41 135.89,65.41 137.16,66.67 142.24,66.67 142.88,67.31 151.13,67.31 CTRL.B10
-GUARD  (1 unrouted)
  Top 0.305: IC6.4 96.52,80.64 97.79,79.38 97.79,65.41 96.52,64.14 IC14.11
-HALT  (1 unrouted)
  Top 0.305: IC2.7 IC2.10
-IEND  (via drill 0.6)  (1 unrouted)
  Top 0.305: v51.44,30.48 51.44,17.78 v52.07,17.14
  Bottom 0.305: UROM3.21 36.83,25.4 39.37,27.94 RN1.2 39.37,30.48 40.01,31.11 50.8,31.11 v51.44,30.48 | v52.07,17.14 52.7,17.78 76.2,17.78 77.47,16.51 IC2.9
-INCA  (via drill 0.6)
  Top 0.305: UROM2.17 46.99,59.69 48.26,60.96 RN3.6 | v80.01,64.14 v80.01,34.29
  Bottom 0.305: RN3.6 48.9,63.5 50.16,64.77 79.38,64.77 v80.01,64.14 | v80.01,34.29 124.46,34.29 125.09,33.66 126.36,33.66 127,34.29 151.13,34.29 CTRL.B23
-INCDR  (via drill 0.6)  (1 unrouted)
  Top 0.305: RN2.3 43.18,6.35 41.91,7.62 UROM3.14 41.91,12.06 43.18,13.34 43.18,25.4 45.72,27.94 v45.72,33.02
  Bottom 0.305: v45.72,33.02 46.35,32.38 57.15,32.38 57.78,33.02 82.55,33.02
-INCPC  (1 unrouted)
  Top 0.305: RN2.2 40.64,6.35 39.37,7.62 UROM3.13 39.37,11.43 40.64,12.7
-IO  (via drill 0.6)  (1 unrouted)
  Top 0.305: RN1.5 46.99,39.37 45.72,40.64 45.72,44.45 46.35,45.09 46.35,51.44 v46.99,52.07
  Bottom 0.305: UROM3.18 44.45,25.4 46.99,27.94 RN1.5 | v46.99,52.07 58.42,52.07
-IRQS  (via drill 0.6)  (1 unrouted)
  Top 0.305: UROM1.25 26.67,78.74 25.4,77.47 25.4,60.96 26.67,59.69 UROM2.25 v26.67,54.61 26.67,45.72 25.4,44.45 25.4,27.3 26.67,26.04 UROM3.25
  Bottom 0.305: v26.67,54.61 27.3,53.98 58.42,53.98
-MEM  (via drill 0.6)  (1 unrouted)
  Top 0.305: RN1.6 49.53,54.61 v50.8,55.88
  Bottom 0.305: UROM3.17 46.99,25.4 49.53,27.94 RN1.6 | v50.8,55.88 51.44,55.24 58.42,55.24
-R  (via drill 0.6)  (1 unrouted)
  Top 0.305: RN1.4 44.45,39.37 43.18,40.64 43.18,44.45 44.45,45.72 44.45,50.16 v45.09,50.8
  Bottom 0.305: UROM3.19 41.91,25.4 44.45,27.94 RN1.4 | v45.09,50.8 58.42,50.8
-RA  (1 unrouted)
-RAGL  (via drill 0.6)  (1 unrouted)
  Top 0.305: IC13.1 118.11,25.4 120.65,27.94 IC13.19 120.65,33.66 119.38,34.92 v119.38,43.81 119.38,63.5 118.11,64.77 IC12.1 118.11,73.03 v118.75,73.66
  Bottom 0.305: CTRL.B20 151.13,41.91 148.59,41.91 146.69,43.81 v119.38,43.81 | IC12.19 120.65,74.93 119.38,73.66 v118.75,73.66
-RDR  (1 unrouted)
-RESET  (via drill 0.6)
  Top 0.305: IC7.1 59.69,71.75 60.96,73.03 60.96,79.38 59.69,80.64 IC1.1 59.69,88.27 60.96,89.53 60.96,93.34 v62.87,95.25 | v101.6,10.16 100.33,11.43 100.33,18.41 101.6,19.68 IC4.6 101.6,26.04 100.33,27.3 100.33,33.66 101.6,34.92 IC3.6 101.6,41.27 102.87,42.55 102.87,80.01 101.6,81.28 IC6.6 101.6,87 102.87,88.27 v102.87,93.34
  Bottom 0.305: CTRL.C30 144.15,9.53 118.75,9.53 118.11,8.89 | 118.11,8.89 IC9.1 | v101.6,10.16 116.84,10.16 118.11,8.89 | IC8.1 118.11,85.09 117.47,85.72 102.23,85.72 101.6,85.09 IC6.6 | v62.87,95.25 101.6,95.25 v102.87,93.34
-RPC  (1 unrouted)
-RSTHOLD  (via drill 0.6)
  Top 0.305: UROM3.4 16.51,11.43 17.78,12.7 17.78,26.04 16.51,27.3 UROM2.4 16.51,44.45 17.78,45.72 17.78,59.69 16.51,60.96 UROM1.4 16.51,77.47 17.78,78.74 17.78,94.61 v19.68,96.52 | v146.69,1.27 147.96,2.54 147.96,13.34 148.59,13.97 153.67,13.97 CTRL.A30 | IC2.1 59.69,8.89 v57.15,11.43 | v66.04,96.52 67.31,95.25 IC1.11 67.31,90.17 68.58,88.9 v71.12,88.9
  Bottom 0.305: v146.69,1.27 76.2,1.27 74.3,3.17 72.39,3.17 71.75,3.81 69.85,3.81 69.22,4.45 67.31,4.45 66.67,5.08 60.96,5.08 59.69,6.35 IC2.1 | v57.15,11.43 17.78,11.43 16.51,10.16 UROM3.4 | v19.68,96.52 v66.04,96.52 | v71.12,88.9 73.03,87 92.08,87 93.98,85.09 IC6.3
-SKIP  (via drill 0.6)  (1 unrouted)
  Top 0.305: UROM1.7 v24.13,64.77 24.13,60.96 25.4,59.69 25.4,45.72 24.13,44.45 UROM2.7 24.13,27.3 25.4,26.04 25.4,12.7 24.13,11.43 UROM3.7
  Bottom 0.305: IC7.2 62.23,67.31 61.59,66.67 43.18,66.67 41.91,65.41 24.77,65.41 v24.13,64.77
-STI  (via drill 0.6)  (1 unrouted)
  Top 0.305: UROM2.20 39.37,59.69 40.64,60.96 RN3.3 40.64,66.04 v41.27,66.67
  Bottom 0.305: v41.27,66.67 41.91,67.31 52.07,67.31
-UOE  (1 unrouted)
-W  (via drill 0.6)  (1 unrouted)
  Top 0.305: RN1.3 41.91,39.37 40.64,40.64 40.64,44.45 41.91,45.72 v41.91,49.53
  Bottom 0.305: UROM3.20 39.37,25.4 41.91,27.94 RN1.3 | v41.91,49.53 45.72,49.53 46.35,50.16 58.42,50.16
-WA  (1 unrouted)
-WALU  (1 unrouted)
-WDR  (1 unrouted)
-WIR  (2 unrouted)
  Top 0.305: IC9.11 140.97,18.41 139.7,19.68 139.7,87.63 140.97,88.9 IC8.11
-WMAR  (via drill 0.6)
  Top 0.305: IC4.13 96.52,33.66 97.79,34.92 v97.79,35.56 | v147.96,36.83 156.21,36.83 156.84,36.2 156.84,33.66 156.21,33.02 CTRL.A23
  Bottom 0.305: v97.79,35.56 98.42,36.2 140.97,36.2 141.6,36.83 v147.96,36.83
-WPC  (1 unrouted)
AINDEX  (via drill 0.6)  (1 unrouted)
  Top 0.305: UROM1.8 26.67,60.96 27.94,59.69 v27.94,55.24 27.94,45.72 26.67,44.45 UROM2.8 26.67,27.3 27.94,26.04 27.94,12.7 26.67,11.43 UROM3.8
  Bottom 0.305: v27.94,55.24 28.57,54.61 58.42,54.61
CLK1  (via drill 0.6)
  Top 0.305: v146.05,2.54 147.32,3.81 147.32,15.24 CTRL.C29 | IC7.9 77.47,73.66 78.74,72.39 78.74,3.17 v79.38,2.54
  Bottom 0.305: IC2.2 62.23,6.35 62.87,5.71 67.31,5.71 67.94,5.08 69.85,5.08 70.48,4.45 72.39,4.45 73.03,3.81 74.93,3.81 76.2,2.54 v79.38,2.54 80.01,1.91 145.41,1.91 v146.05,2.54
CLK5
  Bottom 0.305: IC4.5 99.06,21.59 99.69,20.95 122.56,20.95 124.46,19.05 153.67,19.05 CTRL.A29
FL  (1 unrouted)
FNEG  (1 unrouted)
FZERO  (1 unrouted)
GND  (via drill 0.6)  (5 unrouted)
  Top 0.305: IC1.3 64.77,85.09 65.41,85.72 69.22,85.72 69.85,85.09 | 69.85,85.09 IC1.5 | 69.85,85.09 70.48,85.72 74.3,85.72 74.93,85.09 IC1.7
  Top 1.27: IC1.7 v74.93,79.38
  pour Bottom (isolate 0.635, no thermals): 0,0 160.02,0 160.02,99.06 0,99.06
IBUS0
  Top 0.305: IC12.18 IC8.3
  Bottom 0.305: IC12.18 123.19,77.47 123.83,78.11 136.53,78.11 137.16,78.74 CTRL.C5
IBUS1  (1 unrouted)
  Top 0.305: IC12.17 IC8.4
IBUS2  (via drill 0.6)  (1 unrouted)
  Top 0.305: IC12.16 v128.27,80.64
  Bottom 0.305: v128.27,80.64 131.44,80.64 133.35,82.55 IC8.7
IBUS3  (via drill 0.6)  (1 unrouted)
  Top 0.305: v134.62,74.3 v134.62,80.01
  Bottom 0.305: IC8.8 135.89,81.28 v134.62,80.01 | v134.62,74.3 131.44,74.3 130.81,74.93 IC12.15
IBUS4  (via drill 0.6)  (1 unrouted)
  Top 0.305: IC8.13 135.89,88.27 v134.62,87 | IC12.14 133.35,80.64 v133.99,81.28
  Bottom 0.305: v134.62,87 134.62,81.92 v133.99,81.28
IBUS5  (1 unrouted)
  Top 0.305: IC8.14 133.35,86.36 134.62,85.09 134.62,82.55 135.89,81.28 IC12.13
IBUS6  (2 unrouted)
IBUS7  (via drill 0.6)  (1 unrouted)
  Top 0.305: IC12.11 140.97,71.75 142.24,70.48 142.24,61.59 v142.88,60.96
  Bottom 0.305: v142.88,60.96 CTRL.C12
IBUS8  (1 unrouted)
  Top 0.305: IC9.3 123.19,10.79 121.92,12.06 121.92,26.04 123.19,27.3 IC13.18
IBUS9  (via drill 0.6)
  Top 0.305: IC9.4 v125.73,10.79 124.46,12.06 124.46,26.67 125.73,27.94 IC13.17 | CTRL.C22 147.96,33.66 147.96,22.23 145.41,19.68 145.41,12.7 v143.51,10.79
  Bottom 0.305: v125.73,10.79 v143.51,10.79
IBUS10  (via drill 0.6)
  Top 0.305: IC9.7 133.35,12.06 132.08,13.34 132.08,17.78 129.54,20.32 v129.54,27.3
  Bottom 0.305: CTRL.C23 149.22,33.66 130.18,33.66 128.27,31.75 IC13.16 128.27,28.57 v129.54,27.3
IBUS11  (1 unrouted)
  Top 0.305: IC9.8 135.89,12.06 134.62,13.34 134.62,18.41
  Bottom 0.305: IC13.15 130.81,31.75 131.44,32.38 147.96,32.38 CTRL.C24
IBUS12  (via drill 0.6)  (1 unrouted)
  Top 0.305: IC13.14 133.35,27.94 v134.62,26.67 | IC9.13 v135.89,20.32
  Bottom 0.305: v134.62,26.67 134.62,21.59 v135.89,20.32
IBUS13  (1 unrouted)
  Top 0.305: IC13.13 135.89,26.04 134.62,24.77 134.62,20.32 133.35,19.05 IC9.14
IBUS14  (via drill 0.6)  (1 unrouted)
  Top 0.305: IC9.17 125.73,12.06 127,10.79 v127,5.71 | v144.78,5.08 146.05,6.35 146.05,19.05 CTRL.C27
  Bottom 0.305: v127,5.71 127.64,5.08 v144.78,5.08
IBUS15  (via drill 0.6)  (1 unrouted)
  Top 0.305: IC9.18 123.19,12.06 124.46,10.79 v124.46,5.71 | v145.41,3.81 146.69,5.08 146.69,17.14 CTRL.C28
  Bottom 0.305: v124.46,5.71 125.73,4.45 143.51,4.45 144.15,3.81 v145.41,3.81
IR0  (via drill 0.6)  (1 unrouted)
  Top 0.305: IC8.2 120.65,80.64 119.38,79.38 119.38,74.93 120.65,73.66 IC12.2 | v82.55,76.83 82.55,57.78 v84.45,55.88
  Bottom 0.305: IC21.10 99.06,77.47 98.42,78.11 83.82,78.11 v82.55,76.83 | v84.45,55.88 87.63,55.88 88.9,54.61 IC14.1
IR1  (via drill 0.6)  (1 unrouted)
  Top 0.305: IC8.5 128.27,82.55 127,81.28 v127,74.3 | IC12.3 v123.19,73.66 | IC21.5 99.06,65.41 97.79,64.14 v97.79,50.16
  Bottom 0.305: v123.19,73.66 123.83,74.3 v127,74.3 | v97.79,50.16 97.16,50.16 95.89,51.44 92.08,51.44 91.44,52.07 IC14.2
IR2  (via drill 0.6)  (2 unrouted)
  Top 0.305: v124.46,81.92 124.46,74.93 125.73,73.66 IC12.4
  Bottom 0.305: IC8.6 130.81,82.55 130.18,81.92 v124.46,81.92
IR3  (3 unrouted)
IR4  (2 unrouted)
IR5  (1 unrouted)
  Top 0.305: IC8.15 130.81,87.63 132.08,86.36 132.08,73.03 133.35,71.75 IC12.7
IR6  (via drill 0.6)  (1 unrouted)
  Top 0.305: IC8.16 128.27,88.27 129.54,87 v129.54,66.67
  Bottom 0.305: v129.54,66.67 135.25,66.67 135.89,67.31 IC12.8
IR7  (via drill 0.6)  (1 unrouted)
  Top 0.305: IC12.9 138.43,71.75 137.16,73.03 v137.16,93.34
  Bottom 0.305: v137.16,93.34 136.53,93.98 121.92,93.98 120.65,92.71 IC8.19
IR8  (1 unrouted)
  Top 0.305: IC13.2 120.65,19.68 119.38,18.41 119.38,12.06 120.65,10.79 IC9.2
IR9  (via drill 0.6)  (1 unrouted)
  Top 0.305: v125.73,20.32 127,19.05 127,12.06 128.27,10.79 IC9.5
  Bottom 0.305: IC13.3 123.19,21.59 124.46,20.32 v125.73,20.32
IR10  (via drill 0.6)  (1 unrouted)
  Top 0.305: IC9.6 130.81,11.43 129.54,12.7 129.54,18.41 127,20.95 127,25.4 127.64,26.04 127.64,27.3 127,27.94 127,35.56 125.73,36.83 IC11.4 125.73,41.91 v126.36,42.55 | v121.92,55.24 v121.92,59.05 | v130.81,42.55 IC11.9
  Bottom 0.305: IC10.1 118.11,54.61 118.75,55.24 v121.92,55.24 125.09,55.24 125.73,54.61 IC10.4 | 123.19,59.05 IC10.12 | v121.92,59.05 123.19,59.05 | 123.19,59.05 130.18,59.05 130.81,59.69 IC10.9 | v126.36,42.55 v130.81,42.55
IR11  (via drill 0.6)
  Top 0.305: UROM1.6 21.59,60.96 22.86,59.69 22.86,45.72 21.59,44.45 UROM2.6 21.59,27.3 22.86,26.04 v22.86,12.7 21.59,11.43 UROM3.6 | IC9.9 138.43,3.81 v137.79,3.17 | v50.8,9.53 50.8,12.06 v50.16,12.7 | v79.38,10.16 79.38,4.45 v80.01,3.81
  Bottom 0.305: v79.38,10.16 51.44,10.16 v50.8,9.53 | v50.16,12.7 49.53,12.06 23.5,12.06 v22.86,12.7 | v80.01,3.81 80.64,3.17 v137.79,3.17
IR12  (via drill 0.6)
  Top 0.305: UROM1.5 19.05,60.96 20.32,59.69 20.32,45.72 19.05,44.45 UROM2.5 19.05,27.3 20.32,26.04 v20.32,17.78 20.32,12.7 19.05,11.43 UROM3.5
  Bottom 0.305: IC9.12 138.43,15.88 135.89,18.41 20.95,18.41 v20.32,17.78
IR13  (via drill 0.6)  (1 unrouted)
  Top 0.305: UROM1.27 21.59,78.74 20.32,77.47 20.32,60.96 21.59,59.69 UROM2.27 21.59,45.72 20.32,44.45 20.32,27.3 21.59,26.04 UROM3.27 v21.59,13.34
  Bottom 0.305: v21.59,13.34 22.23,13.97 23.5,13.97 24.77,12.7 48.26,12.7
IR14  (via drill 0.6)  (1 unrouted)
  Top 0.305: UROM1.26 24.13,78.74 22.86,77.47 22.86,60.96 24.13,59.69 UROM2.26 24.13,45.72 22.86,44.45 22.86,27.3 24.13,26.04 UROM3.26 v24.13,17.14
  Bottom 0.305: v24.13,17.14 41.91,17.14
IR15  (via drill 0.6)  (1 unrouted)
  Top 0.305: UROM1.23 31.75,78.74 30.48,77.47 30.48,60.96 31.75,59.69 UROM2.23 31.75,45.72 30.48,44.45 30.48,27.3 31.75,26.04 UROM3.23 v31.75,16.51
  Bottom 0.305: v31.75,16.51 41.91,15.24
N$1  (via drill 0.6)
  Top 0.305: UROM1.24 v29.21,87 29.21,78.74 27.94,77.47 27.94,60.96 29.21,59.69 UROM2.24 29.21,45.72 27.94,44.45 27.94,27.3 29.21,26.04 UROM3.24
  Bottom 0.305: IC1.2 62.23,85.09 61.59,85.72 46.99,85.72 45.09,87.63 29.84,87.63 v29.21,87
N$3  (1 unrouted)
  Bottom 0.305: IC14.13 IC14.12
OP1_BRANCH  (1 unrouted)
OP2_ROLL  (1 unrouted)
OPIF0  (via drill 0.6)  (1 unrouted)
  Top 0.305: RN5.2 UROM1.21 36.83,80.01 v38.1,78.74 | v66.04,78.74 66.04,50.16 64.77,48.9 IC17.14
  Bottom 0.305: v66.04,78.74 64.14,80.64 46.35,80.64 44.45,78.74 v38.1,78.74
OPIF1  (1 unrouted)
  Bottom 0.305: UROM2.13 39.37,40.64 40.64,39.37 RN4.2 40.64,36.83 41.27,36.2 61.59,36.2 62.23,36.83 IC17.2
OPIF2  (via drill 0.6)  (1 unrouted)
  Top 0.305: v43.18,32.38 RN4.3
  Bottom 0.305: UROM2.14 41.91,40.64 43.18,39.37 RN4.3 | v43.18,32.38 43.81,31.75 57.78,31.75 58.42,32.38 64.14,32.38 64.77,31.75 IC18.14
OPIF3  (via drill 0.6)  (1 unrouted)
  Top 0.305: IC18.2 62.23,26.04 63.5,27.3 v63.5,40.01
  Bottom 0.305: UROM2.15 44.45,40.64 45.72,39.37 | 45.72,39.37 RN4.4 | v63.5,40.01 62.87,40.64 53.98,40.64 53.34,40.01 46.35,40.01 45.72,39.37
PAGE0  (via drill 0.6)
  Top 0.305: IC10.3 123.19,50.16 124.46,48.9 v124.46,28.57 | IC13.4 125.73,26.04 v126.36,26.67
  Bottom 0.305: v126.36,26.67 v124.46,28.57
PAGE1
  Top 0.305: IC10.6 130.81,50.16 129.54,48.9 129.54,29.21 128.27,27.94 IC13.5
PAGE2
  Top 0.305: IC10.8 133.35,56.52 132.08,55.24 132.08,27.3 130.81,26.04 IC13.6
PAGE3  (1 unrouted)
PAGE4  (via drill 0.6)
  Top 0.305: v134.62,28.57 v134.62,40.01
  Bottom 0.305: IC11.6 130.81,39.37 131.44,40.01 v134.62,40.01 | v134.62,28.57 135.89,27.3 IC13.8
PAGE5
  Top 0.305: IC11.8 133.35,44.45 137.16,40.64 137.16,27.3 138.43,26.04 IC13.9
PC10  (1 unrouted)
PC11  (via drill 0.6)
  Top 0.305: v127,62.87 127,57.78 128.27,56.52 IC10.5
  Bottom 0.305: CTRL.B13 151.13,59.69 137.79,59.69 133.99,62.87 v127,62.87
PC12  (via drill 0.6)
  Top 0.305: IC10.10 128.27,59.05 128.91,58.42 v131.44,58.42
  Bottom 0.305: v131.44,58.42 132.72,57.15 151.13,57.15 CTRL.B14
PC13  (via drill 0.6)
  Top 0.305: v137.16,62.23 137.16,56.52 v137.79,55.88
  Bottom 0.305: IC10.13 120.65,62.23 122.56,64.14 134.62,64.14 v137.16,62.23 | v137.79,55.88 139.06,54.61 151.13,54.61 CTRL.B15
PC14  (via drill 0.6)
  Top 0.305: IC11.5 128.27,42.55 127,43.81 v127,47.62
  Bottom 0.305: v127,47.62 127.64,48.26 146.05,48.26 147.32,49.53 151.13,49.53 CTRL.B16
PC15  (1 unrouted)
RESERVED_POWER  (1 unrouted)
  Top 1.27: CTRL.C4 CTRL.A4
RSTHOLD  (via drill 0.6)
  Top 0.305: IC18.1 59.69,26.04 60.96,27.3 60.96,33.02 59.69,34.29 IC17.1 59.69,41.27 60.96,42.55 60.96,71.12 63.5,73.66 63.5,87.63 v64.77,88.9
  Bottom 0.305: IC1.10 69.85,90.17 68.58,88.9 v64.77,88.9
RUNIT0  (2 unrouted)
  Top 0.305: UROM1.13 39.37,73.66 41.91,71.12 RN6.2
RUNIT1  (2 unrouted)
  Top 0.305: RN6.3 44.45,71.12 41.91,73.66 UROM1.14
RUNIT2  (via drill 0.6)  (1 unrouted)
  Top 0.305: IC3.3 93.98,41.27 92.71,42.55 92.71,55.88 90.17,58.42 90.17,79.38 88.9,80.64 IC6.1 | UROM1.15 v44.45,80.64 | RN6.4 46.99,71.12 v44.45,73.66
  Bottom 0.305: IC6.1 88.9,82.55 87.63,81.28 45.09,81.28 v44.45,80.64 | v44.45,73.66 UROM1.15
RUNIT3  (via drill 0.6)  (1 unrouted)
  Top 0.305: RN5.6 UROM1.17 46.99,87.63 v47.62,87 | IC6.2 91.44,81.28 92.71,80.01 92.71,73.66 95.25,71.12 95.25,50.8 97.79,48.26 97.79,42.55 99.06,41.27 IC3.5
  Bottom 0.305: IC6.2 91.44,85.09 90.17,86.36 48.26,86.36 v47.62,87
SKIP0  (via drill 0.6)
  Top 0.305: IC7.4 67.31,50.16 68.58,48.9 v68.58,25.4
  Bottom 0.305: v68.58,25.4 73.66,25.4 74.93,24.13 IC18.7
SL  (1 unrouted)
SN
  Top 0.305: IC21.3 93.98,65.41 92.71,64.14 92.71,57.78 93.98,56.52 IC14.3
SX  (1 unrouted)
SZ  (via drill 0.6)
  Top 0.305: IC21.6 101.6,65.41 100.33,64.14 v100.33,51.44
  Bottom 0.305: v100.33,51.44 97.16,51.44 96.52,52.07 IC14.4
UINSTR18  (via drill 0.6)
  Top 0.305: RN2.4 45.72,6.35 44.45,7.62 UROM3.15 44.45,12.06 45.72,13.34 v45.72,13.97 | v7.62,15.88 7.62,71.12 8.26,71.75 v8.89,71.75
  Bottom 0.305: v45.72,13.97 45.09,13.34 25.4,13.34 24.13,14.61 8.89,14.61 v7.62,15.88 | v8.89,71.75 9.53,72.39 53.98,73.03 56.52,70.48 142.88,70.48 143.51,69.85 153.67,69.85 CTRL.A9
UPC0  (via drill 0.6)
  Top 0.305: v36.2,5.08 36.2,6.35 36.83,6.99 UROM3.12 36.83,11.43 38.1,12.7 38.1,25.4 34.29,29.21 34.29,36.83 36.83,39.37 UROM2.12 36.83,44.45 38.1,45.72 38.1,59.69 36.83,60.96 UROM1.12 | v66.04,3.81 66.04,10.79 64.77,12.06 IC2.14
  Bottom 0.305: UPC.1 21.59,35.56 31.75,35.56 36.83,40.64 UROM2.12 | v36.2,5.08 36.2,3.81 36.83,3.17 65.41,3.17 v66.04,3.81
UPC1  (via drill 0.6)
  Top 0.305: UROM1.11 34.29,66.04 33.02,64.77 33.02,62.23 35.56,59.69 35.56,45.72 34.29,44.45 UROM2.11 34.29,39.37 33.02,38.1 33.02,27.94 35.56,25.4 35.56,12.7 34.29,11.43 UROM3.11 v34.29,5.08 | v68.58,3.17 68.58,10.79 67.31,12.06 IC2.13
  Bottom 0.305: UPC.3 20.32,36.83 30.48,36.83 34.29,40.64 UROM2.11 | v34.29,5.08 34.29,3.81 35.56,2.54 67.94,2.54 v68.58,3.17
UPC2  (via drill 0.6)
  Top 0.305: UROM1.10 31.75,60.96 33.02,59.69 33.02,45.72 31.75,44.45 UROM2.10 31.75,27.3 33.02,26.04 33.02,12.7 31.75,11.43 UROM3.10 v31.75,5.08 | v71.12,2.54 71.12,10.79 69.85,12.06 IC2.12
  Bottom 0.305: UPC.5 19.05,38.1 29.21,38.1 31.75,40.64 UROM2.10 | v31.75,5.08 31.75,3.81 33.66,1.91 70.48,1.91 v71.12,2.54
UPC3  (via drill 0.6)
  Top 0.305: UROM1.9 29.21,60.96 30.48,59.69 30.48,45.72 29.21,44.45 UROM2.9 29.21,27.3 30.48,26.04 30.48,12.7 29.21,11.43 UROM3.9 v29.21,5.08 | v73.66,1.91 73.66,10.79 72.39,12.06 IC2.11
  Bottom 0.305: UPC.7 17.78,39.37 27.94,39.37 29.21,40.64 UROM2.9 | v29.21,5.08 29.21,3.81 31.75,1.27 73.03,1.27 v73.66,1.91
VCC  (2 unrouted)
  Top 0.305: 38.1,40.01 38.1,43.81 | RN3.1 35.56,76.83 | RN6.1 38.1,71.12 38.1,76.83
  Bottom 0.305: IC17.16 59.69,46.99 60.33,47.62 61.59,47.62 62.23,46.99 IC17.15
  pour Top (isolate 0.635, no thermals): 0,0 160.02,0 160.02,99.06 0,99.06
WUNIT0  (via drill 0.6)
  Top 0.305: RN5.5 UROM1.18 44.45,87 v43.81,86.36 | v5.71,20.32 5.08,20.95 v5.08,83.19
  Bottom 0.305: v43.81,86.36 43.18,86.36 40.64,83.82 31.75,83.82 31.11,83.19 v5.08,83.19 | v5.71,20.32 87.63,20.32 88.9,21.59 IC4.1
WUNIT1  (via drill 0.6)
  Top 0.305: RN5.4 UROM1.19 41.91,87 v41.27,86.36 | v4.45,19.05 3.81,19.68 v3.81,83.82
  Bottom 0.305: v41.27,86.36 40.64,86.36 39.37,85.09 31.11,85.09 30.48,84.45 4.45,84.45 v3.81,83.82 | v4.45,19.05 7.62,19.05 8.26,19.68 89.53,19.68 91.44,21.59 IC4.2
WUNIT2  (via drill 0.6)
  Top 0.305: RN5.3 UROM1.20 39.37,87 v38.73,86.36 | v3.17,17.78 2.54,18.41 v2.54,84.45
  Bottom 0.305: v38.73,86.36 30.48,86.36 29.84,85.72 3.81,85.72 v2.54,84.45 | v3.17,17.78 7.62,17.78 8.89,19.05 91.44,19.05 93.98,21.59 IC4.3
YA
  Top 0.305: IC17.7 74.93,34.29 73.66,33.02 73.66,27.3 72.39,26.04 IC18.6
YB  (1 unrouted)

### Text on the board
tNames: uPC3 | uPC2 | uPC1 | uPC0